# EAGLE design cnc-cape (EAGLE 6.6.0)

## Sheet 1 of 4
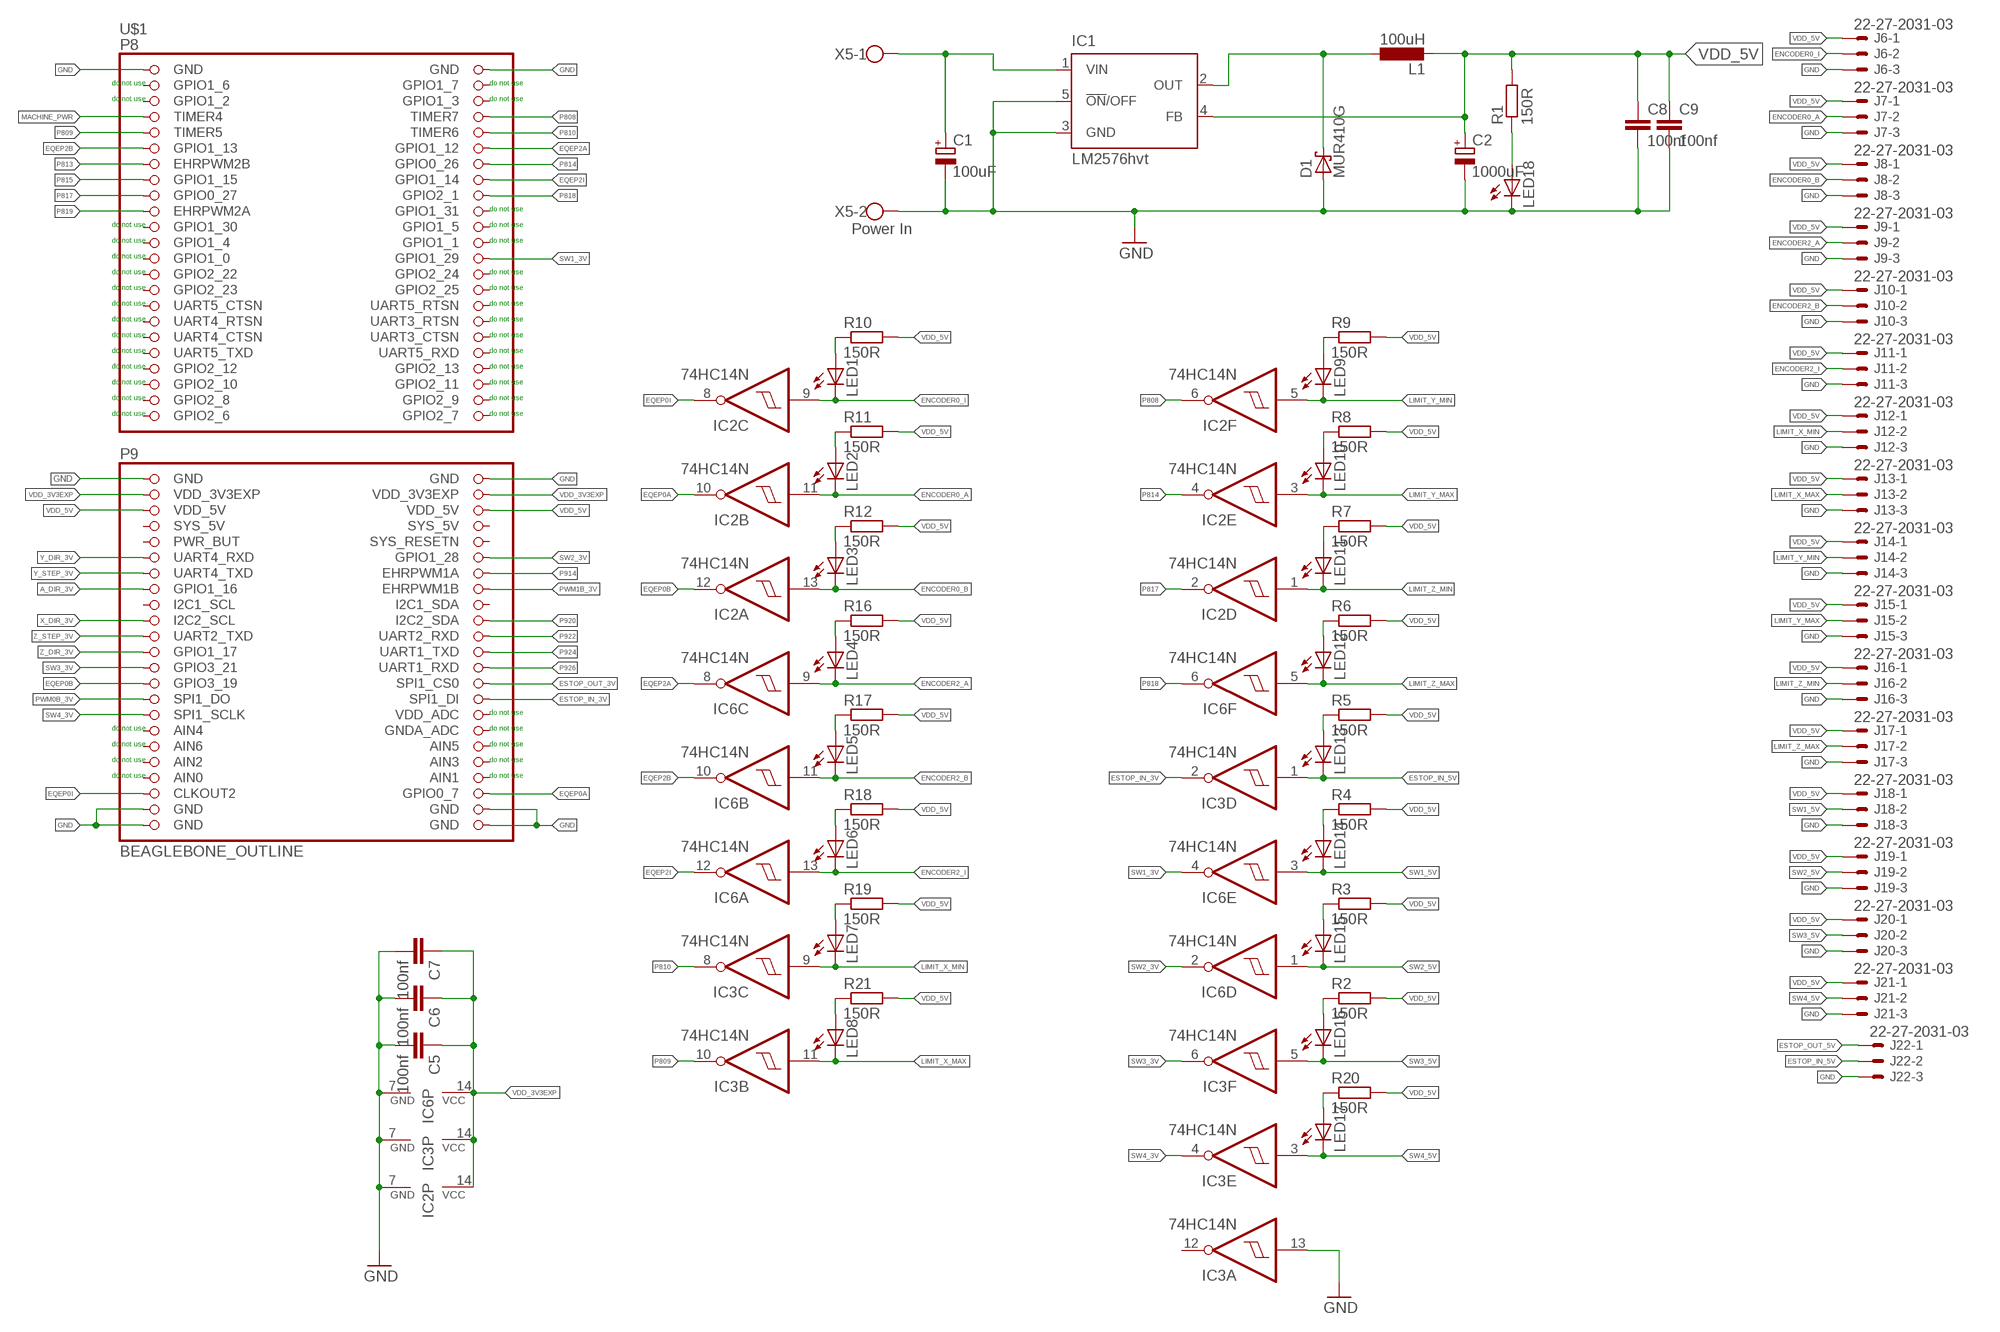
[diagram p0: schematic, sheet 1]

### Parts
C1  100uF  CPOL-EUE5-10.5  [E5-10,5]
C2  1000uF  CPOL-EUE5-10.5  [E5-10,5]
C5  100nf  C-EU050-024X044  [C050-024X044]
C6  100nf  C-EU050-024X044  [C050-024X044]
C7  100nf  C-EU050-024X044  [C050-024X044]
C8  100nf  C-EU050-024X044  [C050-024X044]
C9  100nf  C-EU050-024X044  [C050-024X044]
D1  MUR410G  SCHOTTKY-DIODEDO201T15  [DO201T15]
IC1  LM2576hvt  LM2596T  [T05D]
IC2  74HC14N  [DIL14]
IC3  74HC14N  [DIL14]
IC6  74HC14N  [DIL14]
J6  22-27-2031-03  [6410-03]
J7  22-27-2031-03  [6410-03]
J8  22-27-2031-03  [6410-03]
J9  22-27-2031-03  [6410-03]
J10  22-27-2031-03  [6410-03]
J11  22-27-2031-03  [6410-03]
J12  22-27-2031-03  [6410-03]
J13  22-27-2031-03  [6410-03]
J14  22-27-2031-03  [6410-03]
J15  22-27-2031-03  [6410-03]
J16  22-27-2031-03  [6410-03]
J17  22-27-2031-03  [6410-03]
J18  22-27-2031-03  [6410-03]
J19  22-27-2031-03  [6410-03]
J20  22-27-2031-03  [6410-03]
J21  22-27-2031-03  [6410-03]
J22  22-27-2031-03  [6410-03]
L1  100uH  L-EU  [KM-4.0]
LED1  LED3MM  [LED3MM]
LED2  LED3MM  [LED3MM]
LED3  LED3MM  [LED3MM]
LED4  LED3MM  [LED3MM]
LED5  LED3MM  [LED3MM]
LED6  LED3MM  [LED3MM]
LED7  LED3MM  [LED3MM]
LED8  LED3MM  [LED3MM]
LED9  LED3MM  [LED3MM]
LED10  LED3MM  [LED3MM]
LED11  LED3MM  [LED3MM]
LED12  LED3MM  [LED3MM]
LED13  LED3MM  [LED3MM]
LED14  LED3MM  [LED3MM]
LED15  LED3MM  [LED3MM]
LED16  LED3MM  [LED3MM]
LED17  LED3MM  [LED3MM]
LED18  LED3MM  [LED3MM]
R1  150R  R-EU_0204/5  [0204/5]
R2  150R  R-EU_0204/5  [0204/5]
R3  150R  R-EU_0204/5  [0204/5]
R4  150R  R-EU_0204/5  [0204/5]
R5  150R  R-EU_0204/5  [0204/5]
R6  150R  R-EU_0204/5  [0204/5]
R7  150R  R-EU_0204/5  [0204/5]
R8  150R  R-EU_0204/5  [0204/5]
R9  150R  R-EU_0204/5  [0204/5]
R10  150R  R-EU_0204/5  [0204/5]
R11  150R  R-EU_0204/5  [0204/5]
R12  150R  R-EU_0204/5  [0204/5]
R16  150R  R-EU_0204/5  [0204/5]
R17  150R  R-EU_0204/5  [0204/5]
R18  150R  R-EU_0204/5  [0204/5]
R19  150R  R-EU_0204/5  [0204/5]
R20  150R  R-EU_0204/5  [0204/5]
R21  150R  R-EU_0204/5  [0204/5]
U$1  BEAGLEBONE_OUTLINE  [BEAGLEBONE_SHIELD]
X5  Power In  W237-102  [W237-102]

### Nets
A_DIR_3V: U$1.61(GPIO1_16) ; also sheet 2
ENCODER0_A: IC2.11(B:I) J7.2 LED2.K(C)
ENCODER0_B: IC2.13(A:I) J8.2 LED3.K(C)
ENCODER0_I: IC2.9(C:I) J6.2 LED1.K(C)
ENCODER2_A: IC6.9(C:I) J9.2 LED4.K(C)
ENCODER2_B: IC6.11(B:I) J10.2 LED5.K(C)
ENCODER2_I: IC6.13(A:I) J11.2 LED6.K(C)
EQEP0A: IC2.10(B:O) U$1.88(GPIO0_7)
EQEP0B: IC2.12(A:O) U$1.73(GPIO3_19)
EQEP0I: IC2.8(C:O) U$1.87(CLKOUT2)
EQEP2A: IC6.8(C:O) U$1.12(GPIO1_12)
EQEP2B: IC6.10(B:O) U$1.11(GPIO1_13)
EQEP2I: IC6.12(A:O) U$1.16(GPIO1_14)
ESTOP_IN_3V: IC3.2(D:O) U$1.76(SPI1_DI)
ESTOP_IN_5V: IC3.1(D:I) J22.2 LED13.K(C) ; also sheet 2
ESTOP_OUT_3V: U$1.74(SPI1_CS0) ; also sheet 2
ESTOP_OUT_5V: J22.1 ; also sheet 2
GND [power]: C1.- C2.- C5.2 C6.2 C7.2 C8.2 C9.2 D1.A IC1.3(GND) IC1.5(!ON!/OFF) IC2.7(P:GND) IC3.7(P:GND) IC3.13(A:I) IC6.7(P:GND) J6.3 J7.3 J8.3 J9.3 J10.3 J11.3 J12.3 J13.3 J14.3 J15.3 J16.3 J17.3 J18.3 J19.3 J20.3 J21.3 J22.3 LED18.K(C) U$1.1(GND) U$1.2(GND) U$1.47(GND) U$1.48(GND) U$1.89(GND) U$1.90(GND) U$1.91(GND) U$1.92(GND) X5.2 ; also sheet 2,3,4
LIMIT_X_MAX: IC3.11(B:I) J13.2 LED8.K(C)
LIMIT_X_MIN: IC3.9(C:I) J12.2 LED7.K(C)
LIMIT_Y_MAX: IC2.3(E:I) J15.2 LED10.K(C)
LIMIT_Y_MIN: IC2.5(F:I) J14.2 LED9.K(C)
LIMIT_Z_MAX: IC6.5(F:I) J17.2 LED12.K(C)
LIMIT_Z_MIN: IC2.1(D:I) J16.2 LED11.K(C)
MACHINE_PWR: U$1.7(TIMER4) ; also sheet 2
N$1: LED8.A R21.1
N$2: LED7.A R19.1
N$3: D1.C IC1.2(OUT) L1.P$1
N$4: LED6.A R18.1
N$5: LED5.A R17.1
N$6: LED4.A R16.1
N$7: LED16.A R2.1
N$8: LED15.A R3.1
N$9: LED14.A R4.1
N$10: LED13.A R5.1
N$11: LED12.A R6.1
N$12: LED3.A R12.1
N$13: LED2.A R11.1
N$16: LED1.A R10.1
N$40: LED9.A R9.1
N$41: LED10.A R8.1
N$42: LED11.A R7.1
N$43: LED17.A R20.1
N$44: LED18.A R1.1
P808: IC2.6(F:O) U$1.8(TIMER7)
P809: IC3.10(B:O) U$1.9(TIMER5)
P810: IC3.8(C:O) U$1.10(TIMER6)
P813: U$1.13(EHRPWM2B) ; also sheet 2
P814: IC2.4(E:O) U$1.14(GPIO0_26)
P815: U$1.15(GPIO1_15) ; also sheet 2
P817: IC2.2(D:O) U$1.17(GPIO0_27)
P818: IC6.6(F:O) U$1.18(GPIO2_1)
P819: U$1.19(EHRPWM2A) ; also sheet 2
P914: U$1.60(EHRPWM1A) ; also sheet 2
P920: U$1.66(I2C2_SDA) ; also sheet 2
P922: U$1.68(UART2_RXD) ; also sheet 2
P924: U$1.70(UART1_TXD) ; also sheet 2
P926: U$1.72(UART1_RXD) ; also sheet 2
PWM0B_3V: U$1.75(SPI1_DO) ; also sheet 2
PWM1B_3V: U$1.62(EHRPWM1B) ; also sheet 2
SW1_3V: IC6.4(E:O) U$1.26(GPIO1_29)
SW1_5V: IC6.3(E:I) J18.2 LED14.K(C)
SW2_3V: IC6.2(D:O) U$1.58(GPIO1_28)
SW2_5V: IC6.1(D:I) J19.2 LED15.K(C)
SW3_3V: IC3.6(F:O) U$1.71(GPIO3_21)
SW3_5V: IC3.5(F:I) J20.2 LED16.K(C)
SW4_3V: IC3.4(E:O) U$1.77(SPI1_SCLK)
SW4_5V: IC3.3(E:I) J21.2 LED17.K(C)
VCC [power]: C1.+ IC1.1(VIN) X5.1
VDD_3V3EXP [power]: C5.1 C6.1 C7.1 IC2.14(P:VCC) IC3.14(P:VCC) IC6.14(P:VCC) U$1.49(VDD_3V3EXP) U$1.50(VDD_3V3EXP)
VDD_5V [power]: C2.+ C8.1 C9.1 IC1.4(FB) J6.1 J7.1 J8.1 J9.1 J10.1 J11.1 J12.1 J13.1 J14.1 J15.1 J16.1 J17.1 J18.1 J19.1 J20.1 J21.1 L1.P$2 R1.2 R2.2 R3.2 R4.2 R5.2 R6.2 R7.2 R8.2 R9.2 R10.2 R11.2 R12.2 R16.2 R17.2 R18.2 R19.2 R20.2 R21.2 U$1.51(VDD_5V) U$1.52(VDD_5V) ; also sheet 2,3,4
X_DIR_3V: U$1.65(I2C2_SCL) ; also sheet 2
Y_DIR_3V: U$1.57(UART4_RXD) ; also sheet 2
Y_STEP_3V: U$1.59(UART4_TXD) ; also sheet 2
Z_DIR_3V: U$1.69(GPIO1_17) ; also sheet 2
Z_STEP_3V: U$1.67(UART2_TXD) ; also sheet 2
Unconnected: IC3.12(A:O) U$1.3(GPIO1_6) U$1.4(GPIO1_7) U$1.5(GPIO1_2) U$1.6(GPIO1_3) U$1.20(GPIO1_31) U$1.21(GPIO1_30) U$1.22(GPIO1_5) U$1.23(GPIO1_4) U$1.24(GPIO1_1) U$1.25(GPIO1_0) U$1.27(GPIO2_22) U$1.28(GPIO2_24) U$1.29(GPIO2_23) U$1.30(GPIO2_25) U$1.31(UART5_CTSN) U$1.32(UART5_RTSN) U$1.33(UART4_RTSN) U$1.34(UART3_RTSN) U$1.35(UART4_CTSN) U$1.36(UART3_CTSN) U$1.37(UART5_TXD) U$1.38(UART5_RXD) U$1.39(GPIO2_12) U$1.40(GPIO2_13) U$1.41(GPIO2_10) U$1.42(GPIO2_11) U$1.43(GPIO2_8) U$1.44(GPIO2_9) U$1.45(GPIO2_6) U$1.46(GPIO2_7) U$1.54(SYS_5V) U$1.55(PWR_BUT) U$1.56(SYS_RESETN) U$1.63(I2C1_SCL) U$1.64(I2C1_SDA) U$1.78(VDD_ADC) U$1.79(AIN4) U$1.80(GNDA_ADC) U$1.81(AIN6) U$1.82(AIN5) U$1.83(AIN2) U$1.84(AIN3) U$1.86(AIN1)

### Notes on the sheet
- do not use | do not use
- do not use | do not use
- do not use
- do not use | do not use
- do not use | do not use
- do not use
- do not use | do not use
- do not use | do not use
- do not use | do not use
- do not use | do not use
- do not use | do not use
- do not use | do not use
- do not use | do not use
- do not use | do not use
- do not use | do not use
- do not use | do not use
- do not use
- do not use | do not use
- do not use | do not use
- do not use | do not use
- do not use | do not use

## Sheet 2 of 4
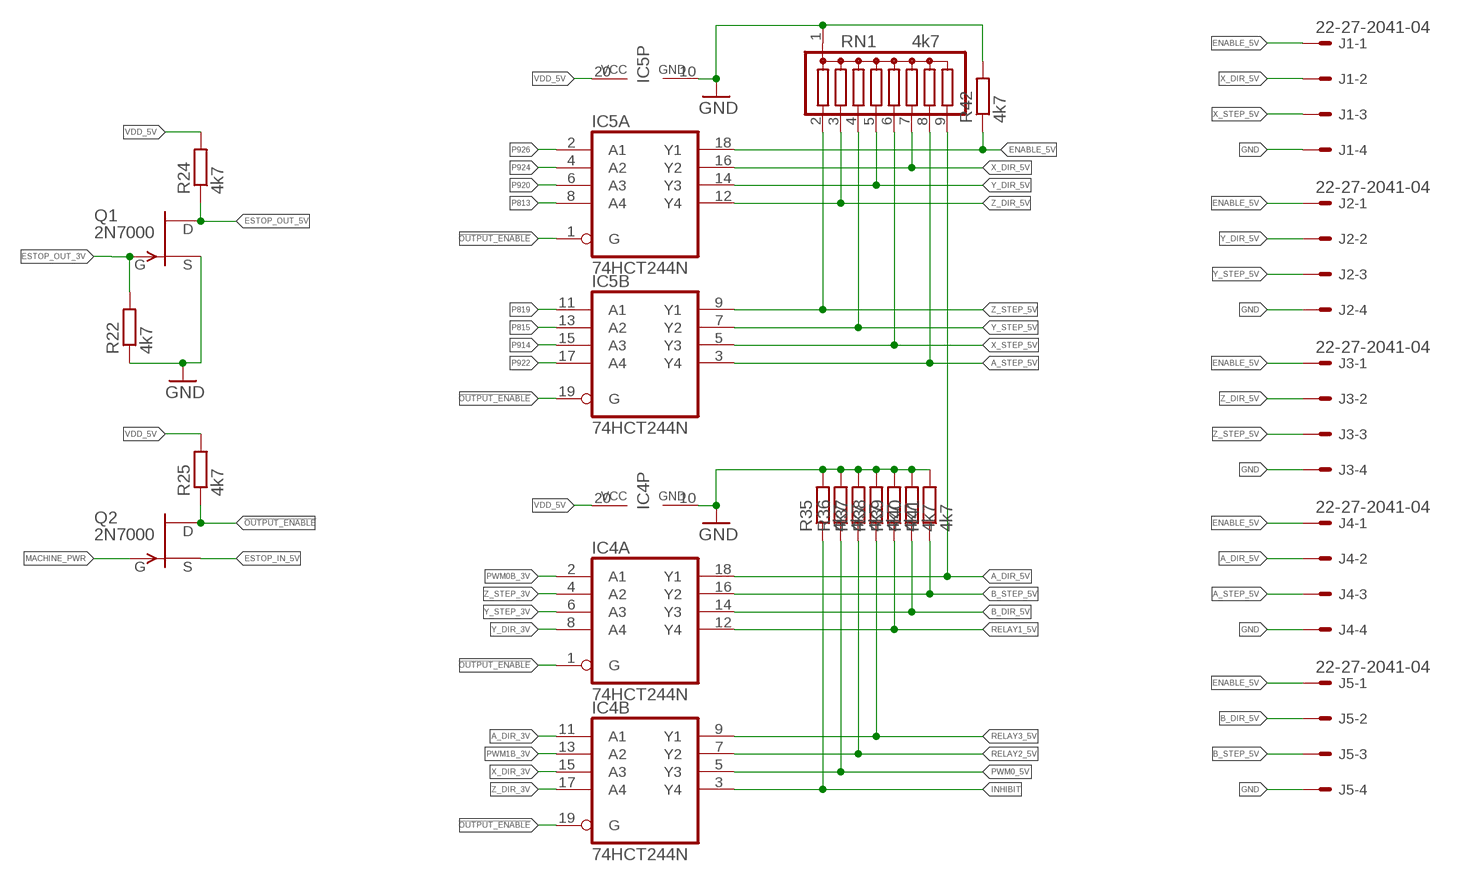
[diagram p1: schematic, sheet 2]

### Parts
IC4  74HCT244N  [DIL20]
IC5  74HCT244N  [DIL20]
J1  22-27-2041-04  [6410-04]
J2  22-27-2041-04  [6410-04]
J3  22-27-2041-04  [6410-04]
J4  22-27-2041-04  [6410-04]
J5  22-27-2041-04  [6410-04]
Q1  2N7000  2N3819  [TO92]
Q2  2N7000  2N3819  [TO92]
R22  4k7  R-EU_0204/5  [0204/5]
R24  4k7  R-EU_0204/5  [0204/5]
R25  4k7  R-EU_0204/5  [0204/5]
R35  4k7  R-EU_0204/5  [0204/5]
R36  4k7  R-EU_0204/5  [0204/5]
R37  4k7  R-EU_0204/5  [0204/5]
R38  4k7  R-EU_0204/5  [0204/5]
R39  4k7  R-EU_0204/5  [0204/5]
R40  4k7  R-EU_0204/5  [0204/5]
R41  4k7  R-EU_0204/5  [0204/5]
R42  4k7  R-EU_0204/5  [0204/5]
RN1  4k7  G08R  [SIL9]

### Nets
!OUTPUT_ENABLE!: IC4.1(A:G) IC4.19(B:G) IC5.1(A:G) IC5.19(B:G) Q2.1(D) R25.1
A_DIR_3V: IC4.11(B:A1) ; also sheet 1
A_DIR_5V: IC4.18(A:Y1) J4.2 RN1.9
A_STEP_5V: IC5.3(B:Y4) J4.3 RN1.8
B_DIR_5V: IC4.14(A:Y3) J5.2 R40.1
B_STEP_5V: IC4.16(A:Y2) J5.3 R41.1
ENABLE_5V: IC5.18(A:Y1) J1.1 J2.1 J3.1 J4.1 J5.1 R42.1
ESTOP_IN_5V: Q2.3(S) ; also sheet 1
ESTOP_OUT_3V: Q1.2(G) R22.2 ; also sheet 1
ESTOP_OUT_5V: Q1.1(D) R24.1 ; also sheet 1
GND [power]: IC4.10(P:GND) IC5.10(P:GND) J1.4 J2.4 J3.4 J4.4 J5.4 Q1.3(S) R22.1 R35.2 R36.2 R37.2 R38.2 R39.2 R40.2 R41.2 R42.2 RN1.1 ; also sheet 1,3,4
INHIBIT: IC4.3(B:Y4) R35.1 ; also sheet 4
MACHINE_PWR: Q2.2(G) ; also sheet 1
P813: IC5.8(A:A4) ; also sheet 1
P815: IC5.13(B:A2) ; also sheet 1
P819: IC5.11(B:A1) ; also sheet 1
P914: IC5.15(B:A3) ; also sheet 1
P920: IC5.6(A:A3) ; also sheet 1
P922: IC5.17(B:A4) ; also sheet 1
P924: IC5.4(A:A2) ; also sheet 1
P926: IC5.2(A:A1) ; also sheet 1
PWM0_5V: IC4.5(B:Y3) R36.1 ; also sheet 4
PWM0B_3V: IC4.2(A:A1) ; also sheet 1
PWM1B_3V: IC4.13(B:A2) ; also sheet 1
RELAY1_5V: IC4.12(A:Y4) R39.1 ; also sheet 3
RELAY2_5V: IC4.7(B:Y2) R37.1 ; also sheet 3
RELAY3_5V: IC4.9(B:Y1) R38.1 ; also sheet 3
VDD_5V [power]: IC4.20(P:VCC) IC5.20(P:VCC) R24.2 R25.2 ; also sheet 1,3,4
X_DIR_3V: IC4.15(B:A3) ; also sheet 1
X_DIR_5V: IC5.16(A:Y2) J1.2 RN1.7
X_STEP_5V: IC5.5(B:Y3) J1.3 RN1.6
Y_DIR_3V: IC4.8(A:A4) ; also sheet 1
Y_DIR_5V: IC5.14(A:Y3) J2.2 RN1.5
Y_STEP_3V: IC4.6(A:A3) ; also sheet 1
Y_STEP_5V: IC5.7(B:Y2) J2.3 RN1.4
Z_DIR_3V: IC4.17(B:A4) ; also sheet 1
Z_DIR_5V: IC5.12(A:Y4) J3.2 RN1.3
Z_STEP_3V: IC4.4(A:A2) ; also sheet 1
Z_STEP_5V: IC5.9(B:Y1) J3.3 RN1.2

## Sheet 3 of 4
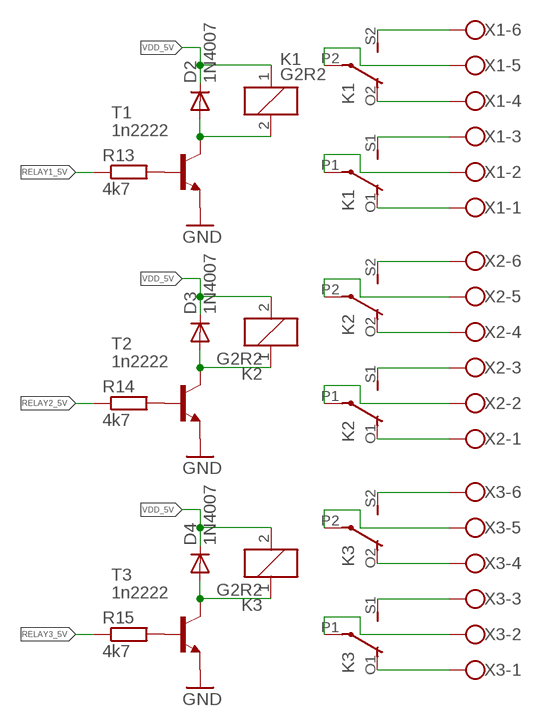
[diagram p2: schematic, sheet 3]

### Parts
D2  1N4007  1N4004  [DO41-10]
D3  1N4007  1N4004  [DO41-10]
D4  1N4007  1N4004  [DO41-10]
K1  G2R2  [G2R2]
K2  G2R2  [G2R2]
K3  G2R2  [G2R2]
R13  4k7  R-EU_0204/5  [0204/5]
R14  4k7  R-EU_0204/5  [0204/5]
R15  4k7  R-EU_0204/5  [0204/5]
T1  1n2222  -NPN-TO92  [TO92]
T2  1n2222  -NPN-TO92  [TO92]
T3  1n2222  -NPN-TO92  [TO92]
X1  W237-6  [W237-6]
X2  W237-6  [W237-6]
X3  W237-6  [W237-6]

### Nets
GND [power]: T1.1(E) T2.1(E) T3.1(E) ; also sheet 1,2,4
N$15: R13.2 T1.2(B)
N$17: D2.A K1.2 T1.3(C)
N$18: K1.S2(3:S) X1.6
N$19: K1.O2(3:O) X1.4
N$20: K1.P2(3:P) X1.5
N$21: K1.S1(2:S) X1.3
N$22: K1.P1(2:P) X1.2
N$23: K1.O1(2:O) X1.1
N$24: R14.2 T2.2(B)
N$25: D3.A K2.1 T2.3(C)
N$26: K2.S2(3:S) X2.6
N$27: K2.O2(3:O) X2.4
N$28: K2.P2(3:P) X2.5
N$29: K2.S1(2:S) X2.3
N$30: K2.P1(2:P) X2.2
N$31: K2.O1(2:O) X2.1
N$32: R15.2 T3.2(B)
N$33: D4.A K3.1 T3.3(C)
N$34: K3.S2(3:S) X3.6
N$35: K3.O2(3:O) X3.4
N$36: K3.P2(3:P) X3.5
N$37: K3.S1(2:S) X3.3
N$38: K3.P1(2:P) X3.2
N$39: K3.O1(2:O) X3.1
RELAY1_5V: R13.1 ; also sheet 2
RELAY2_5V: R14.1 ; also sheet 2
RELAY3_5V: R15.1 ; also sheet 2
VDD_5V [power]: D2.C D3.C D4.C K1.1 K2.2 K3.2 ; also sheet 1,2,4

## Sheet 4 of 4
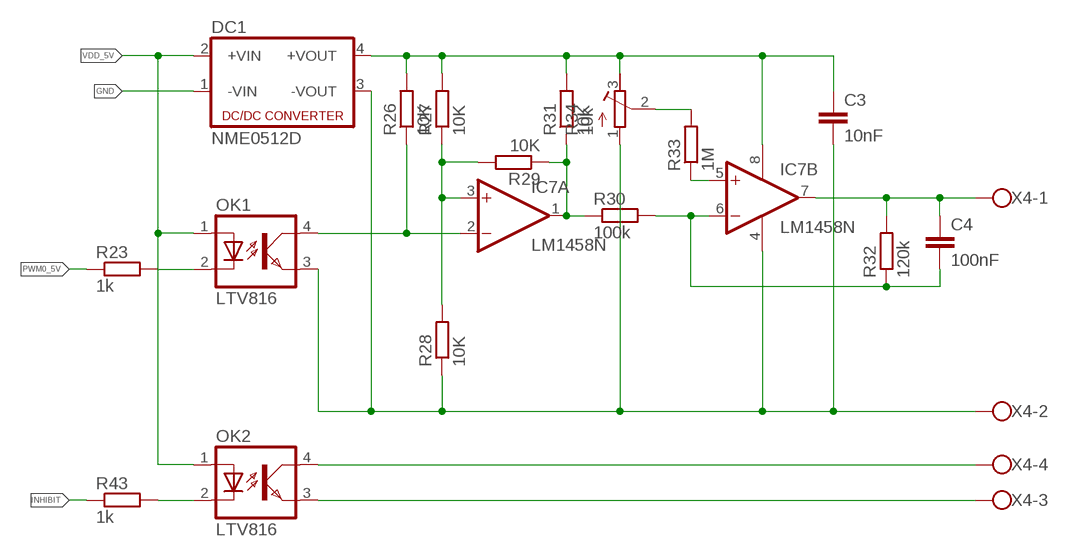
[diagram p3: schematic, sheet 4]

### Parts
C3  10nF  C-EU050-024X044  [C050-024X044]
C4  100nF  C-EU050-024X044  [C050-024X044]
DC1  NME0512D  NME  [NME]
IC7  LM1458N  [DIL08]
OK1  LTV816  [DIL04]
OK2  LTV816  [DIL04]
R23  1k  R-EU_0204/5  [0204/5]
R26  10K  R-EU_0204/5  [0204/5]
R27  10K  R-EU_0204/5  [0204/5]
R28  10K  R-EU_0204/5  [0204/5]
R29  10K  R-EU_0204/5  [0204/5]
R30  100k  R-EU_0204/5  [0204/5]
R31  10K  R-EU_0204/5  [0204/5]
R32  120k  R-EU_0204/5  [0204/5]
R33  1M  R-EU_0204/5  [0204/5]
R34  10k  R-TRIMM64P  [RTRIM64P]
R43  1k  R-EU_0204/5  [0204/5]
X4  W237-4  [W237-4]

### Nets
GND [power]: DC1.1(-VIN) ; also sheet 1,2,3
INHIBIT: R43.1 ; also sheet 2
N$14: C3.1 DC1.4(+VOUT) IC7.8(P:V+) R26.2 R27.2 R31.2 R34.3(E)
N$45: OK1.2(C) R23.2
N$46: OK2.4(COL) X4.4
N$47: IC7.2(A:-IN) OK1.4(COL) R26.1
N$48: IC7.3(A:+IN) R27.1 R28.2 R29.2
N$49: IC7.1(A:OUT) R29.1 R30.1 R31.1
N$50: C4.2 IC7.6(B:-IN) R30.2 R32.1
N$51: OK2.3(EMIT) X4.3
N$52: OK2.2(C) R43.2
N$53: IC7.5(B:+IN) R33.1
N$54: R33.2 R34.2(S)
PWM0_5V: R23.1 ; also sheet 2
SPINDLE+: C4.1 IC7.7(B:OUT) R32.2 X4.1
SPINDLE-: C3.2 DC1.3(-VOUT) IC7.4(P:V-) OK1.3(EMIT) R28.1 R34.1(A) X4.2
VDD_5V [power]: DC1.2(+VIN) OK1.1(A) OK2.1(A) ; also sheet 1,2,3

## Power pins joined to a net without a drawn wire
AIN0: U$1.85(AIN0)
SYS_5V: U$1.53(SYS_5V)

## Library data of the parts
C1 = resistor:CPOL-EU: POLARIZED CAPACITOR, European symbol; FARNELL: 1281843
C2 = resistor:CPOL-EU: POLARIZED CAPACITOR, European symbol; FARNELL: 2346582
C3-C9 = rcl:C-EU: CAPACITOR, European symbol
D1 = diode:SCHOTTKY-DIODE: Schottky Diode; FARNELL: 1459145
D2-D4 = diode:1N4004: DIODE general purpose rectifier, 1 A; FARNELL: 9565051
DC1 = dc-dc-converter:NME: DC-DC CONVERTER; FARNELL: 1021457; MF: C & D TECHNOLOGIES, INC; MPN: NME1205D; OC_FARNELL: 1021466; OC_NEWARK: 98B8198
IC1 = national-semiconductor:LM2596: SIMPLE SWITCHER® Power Converter 150 kHz 3A Step-Down Voltage Regulator Source: http://www.national.com/ds/LM/LM2596.pdf; MPN: LM2596T-ADJ/LF02; OC_FARNELL: 9494162; OC_NEWARK: 65K5910
IC2 IC3 IC6 = 74xx-eu:74*14: Hex schmitt trigger INVERTER; FARNELL: 1739974
IC4 IC5 = 74xx-eu:74*244: Octal BUFFER and LINE DRIVER, 3-state; FARNELL: 382267
IC7 = linear:*1458: OP AMP
J1-J5 = con-molex:22-?-04: CONNECTOR wire to board 2.54 mm (.1 inch) pitch header; FARNELL: 9731164; OC_FARNELL: unknown; OC_NEWARK: unknown
J6-J8 J10-J21 = con-molex:22-?-03: CONNECTOR wire to board 2.54 mm (.1 inch) pitch header; FARNELL: 9731156; OC_FARNELL: unknown; OC_NEWARK: unknown
J9 J22 = con-molex:22-?-03: CONNECTOR wire to board 2.54 mm (.1 inch) pitch header; OC_FARNELL: unknown; OC_NEWARK: unknown
K1-K3 = relay:G2R2: RELAY 2 x switch, Omron; FARNELL: 1703716; MF: OMRON COMPONENTS USA; MPN: G2R-2-DC6; OC_FARNELL: unknown; OC_NEWARK: 89C5317
L1 = library:L-EU: INDUCTOR, European symbol; FARNELL: 1209546
LED1-LED18 = led:LED: LED OSRAM: - CHIPLED LG R971, LG N971, LY N971, LG Q971, LY Q971, LO R971, LY R971 LH N974, LH R974 LS Q976, LO Q976, LY Q976 LO Q996 - Hyper CHIPLED LW Q18S LB Q993, LB Q99A, LB R99A - SideLED LS A670, LO A670, LY A670, LG A670, LP A670 LB A673, LV A673, LT A673, LW A673 LH A674 LY A675 LS A676, LA A676, LO A676, LY A676, LW A676 LS A679, LY A679, LG A679 - Hyper Micro SIDELED® LS Y876, LA Y876, LO Y876, LY Y876 LT Y87S - SmartLED LW L88C, LW L88S LB L89C, LB L89S, LG L890 LS L89K, LO L89K, LY L89K LS L896, LA L896, LO L896, LY L896 - TOPLED LS T670, LO T670, LY T670, LG T670, LP T670 LSG T670, LSP T670, LSY T670, LOP T670, LYG T670 LG T671, LOG T671, LSG T671 LB T673, LV T673, LT T673, LW T673 LH T674 LS T676, LA T676, LO T676, LY T676, LB T676, LH T676, LSB T676, LW T676 LB T67C, LV T67C, LT T67C, LS T67K, LO T67K, LY T67K, LW E67C LS E67B, LA E67B, LO E67B, LY E67B, LB E67C, LV E67C, LT E67C LW T67C LS T679, LY T679, LG T679 LS T770, LO T770, LY T770, LG T770, LP T770 LB T773, LV T773, LT T773, LW T773 LH T774 LS E675, LA E675, LY E675, LS T675 LS T776, LA T776, LO T776, LY T776, LB T776 LHGB T686 LT T68C, LB T68C - Hyper Mini TOPLED® LB M676 - Mini TOPLED Santana® LG M470 LS M47K, LO M47K, LY M47K Source: http://www.osram.convergy.de LUXEON: - LUMILED® LXK2-PW12-R00, LXK2-PW12-S00, LXK2-PW14-U00, LXK2-PW14-V00 LXK2-PM12-R00, LXK2-PM12-S00, LXK2-PM14-U00 LXK2-PE12-Q00, LXK2-PE12-R00, LXK2-PE12-S00, LXK2-PE14-T00, LXK2-PE14-U00 LXK2-PB12-K00, LXK2-PB12-L00, LXK2-PB12-M00, LXK2-PB14-N00, LXK2-PB14-P00, LXK2-PB14-Q00 LXK2-PR12-L00, LXK2-PR12-M00, LXK2-PR14-Q00, LXK2-PR14-R00 LXK2-PD12-Q00, LXK2-PD12-R00, LXK2-PD12-S00 LXK2-PH12-R00, LXK2-PH12-S00 LXK2-PL12-P00, LXK2-PL12-Q00, LXK2-PL12-R00 Source: www.luxeon.com KINGBRIGHT: KA-3528ASYC Source: www.kingbright.com; FARNELL: 1581133
OK1 OK2 = optocoupler:LTV816: OPTO COUPLER Source: LITEON, LTV816.pdf; OC_FARNELL: unknown; OC_NEWARK: unknown
Q1 Q2 = transistor-fet:2N3819: N-Channel Junction FET; FARNELL: 9845178
R1-R12 R16-R21 = resistor:R-EU_: RESISTOR, European symbol; FARNELL: 1700226
R13-R15 R22 R24 R25 = rcl:R-EU_: RESISTOR, European symbol; FARNELL: 1700245
R23 R30 R32 R33 R35-R43 = rcl:R-EU_: RESISTOR, European symbol
R26-R29 R31 = rcl:R-EU_: RESISTOR, European symbol; FARNELL: 1700251
R34 = rcl:R-TRIMM: Trimm resistor
RN1 = resistor-sil:G08R: SIL RESISTOR; FARNELL: 9357025; OC_FARNELL: unknown; OC_NEWARK: unknown
T1-T3 = transistor:*-NPN-: NPN Transistror BF959 corrected 2008.03.06; FARNELL: 1611371
U$1 = adafruit:BEAGLEBONE_OUTLINE: Should match A3 pinout - but not completely tested
X1-X3 = con-wago-500:W237-6: WAGO SCREW CLAMP; FARNELL: 3089071; OC_FARNELL: unknown; OC_NEWARK: unknown
X4 = con-wago-500:W237-4: WAGO SCREW CLAMP; OC_FARNELL: unknown; OC_NEWARK: unknown
X5 = con-wago-500:W237-102: WAGO SCREW CLAMP; FARNELL: 3089034; MPN: 237-102; OC_FARNELL: unknown; OC_NEWARK: 70K9898

## Board
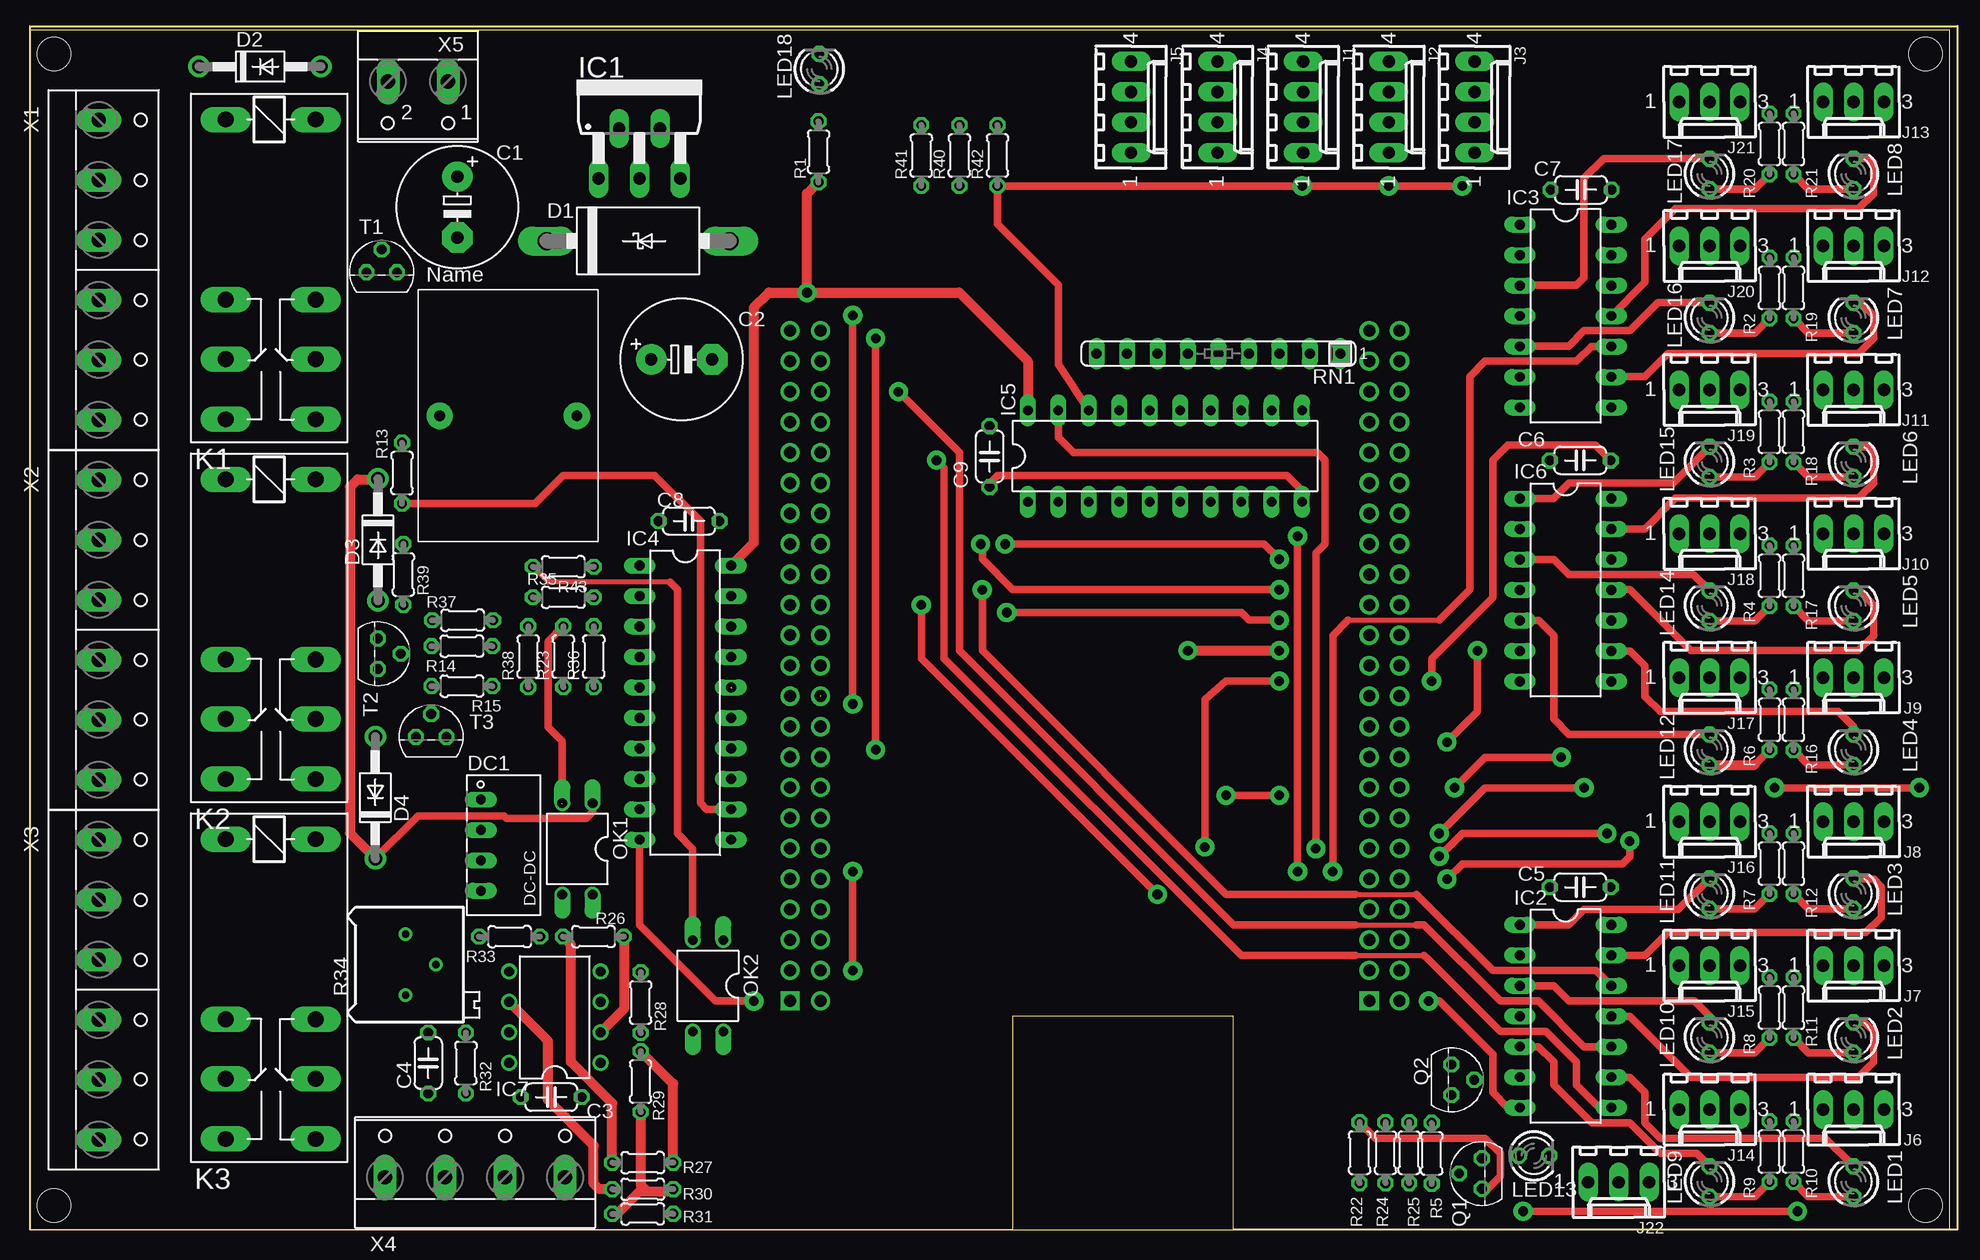
[diagram p4: board, top side]
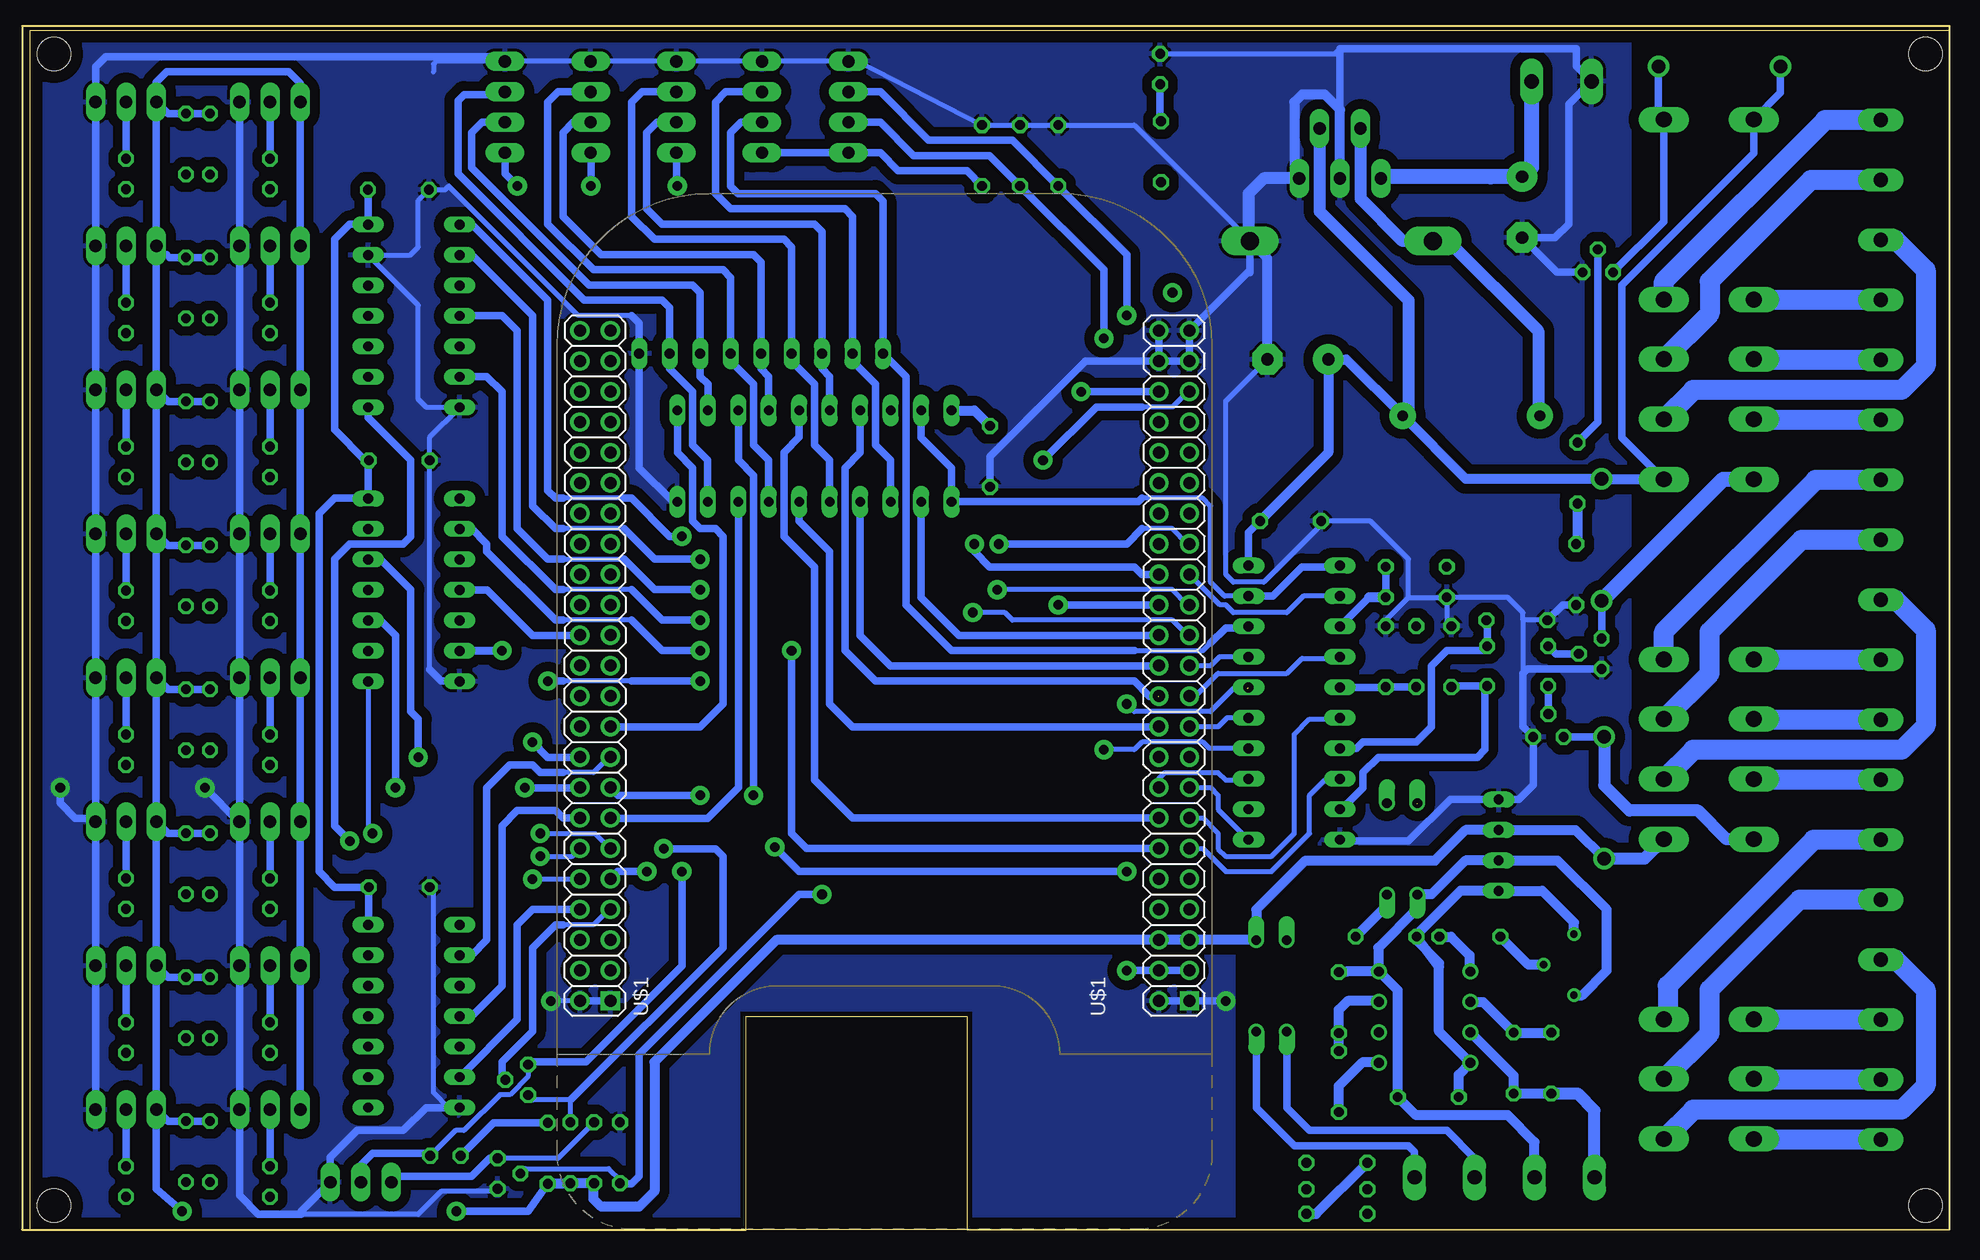
[diagram p5: board, bottom side, seen from below]

Size 160 x 100 mm. Coordinates in mm from the lower left corner, seen from the top.
Outline: 160,0 160,100 0,100 0,0 160,0
Copper layers (1*16): Top 0.035mm / dielectric 1.5mm / Bottom 0.035mm
Design rules "default *": minimum track width 10mil, minimum drill 24mil, track to track 8mil, track to pad 8mil, pad to pad 8mil, via to via 8mil, smd to smd 8mil, copper to edge 40mil, drill to drill 8mil, minimum pad ring 10mil, minimum via ring 8mil, stop-mask expansion 4mil, vias tented up to drill 0mil, thermal gap 10mil
Holes 2.8 mm at 2,2 2,98 158,98 158,2
Milling: 8 lines

### Footprints (pad centres in the part's own frame; a part is rotated, then mirrored left to right if it is on the bottom)
E5-10,5 = drill 1.016 pad 2.54: + -2.54,0 | drill 1.016 pad 2.54 octagon: - 2.54,0
C050-024X044 = drill 0.813 octagon: 1 -2.54,0; 2 2.54,0
DO201T15 = drill 1.499 long: A 7.62,0; C -7.62,0
DO41-10 = drill 1.118: A 5.08,0; C -5.08,0
NME = drill 0.813 long: 1 0,3.81; 2 0,1.27; 3 0,-1.27; 4 0,-3.81
T05D = drill 1.016 long: 1 -3.404,-5.08; 2 -1.702,-0.914; 3 0,-5.08; 4 1.702,-0.914; 5 3.404,-5.08
DIL14 = drill 0.813 long: 1 -7.62,-3.81; 2 -5.08,-3.81; 3 -2.54,-3.81; 4 0,-3.81; 5 2.54,-3.81; 6 5.08,-3.81; 7 7.62,-3.81; 8 7.62,3.81; 9 5.08,3.81; 10 2.54,3.81; 11 0,3.81; 12 -2.54,3.81; 13 -5.08,3.81; 14 -7.62,3.81
DIL20 = drill 0.813 long: 1 -11.43,-3.81; 2 -8.89,-3.81; 3 -6.35,-3.81; 4 -3.81,-3.81; 5 -1.27,-3.81; 6 1.27,-3.81; 7 3.81,-3.81; 8 6.35,-3.81; 9 8.89,-3.81; 10 11.43,-3.81; 11 11.43,3.81; 12 8.89,3.81; 13 6.35,3.81; 14 3.81,3.81; 15 1.27,3.81; 16 -1.27,3.81; 17 -3.81,3.81; 18 -6.35,3.81; 19 -8.89,3.81; 20 -11.43,3.81
DIL08 = drill 0.813 pad 1.27: 1 -3.81,-3.81; 2 -1.27,-3.81; 3 1.27,-3.81; 4 3.81,-3.81; 5 3.81,3.81; 6 1.27,3.81; 7 -1.27,3.81; 8 -3.81,3.81
6410-04 = drill 1.016 long: 1 3.81,0; 2 1.27,0; 3 -1.27,0; 4 -3.81,0
6410-03 = drill 1.016 long: 1 2.54,0; 2 0,0; 3 -2.54,0
G2R2 = drill 1.321 long: 1 -2.54,-3.683; 2 -2.54,3.81; O1 12.471,3.81; O2 12.471,-3.683; P1 17.45,3.81; P2 17.45,-3.683; S1 22.454,3.81; S2 22.454,-3.683
KM-4.0 = drill 0.9 pad 2.184: P$1 -5.72,0; P$2 5.72,0
LED3MM = drill 0.813 octagon: A -1.27,0; K 1.27,0
DIL04 = drill 0.813 offset: 1 -1.27,-3.81; 2 1.27,-3.81; 3 1.27,3.81; 4 -1.27,3.81
TO92 = drill 0.813 octagon: 1 1.27,0; 2 0,1.905; 3 -1.27,0
0204/5 = drill 0.813 octagon: 1 -2.54,0; 2 2.54,0
RTRIM64P = drill 0.61: 1 0,-2.54; 2 2.54,0; 3 0,2.54
SIL9 = drill 0.813 long: 1 -10.16,0; 2 -7.62,0; 3 -5.08,0; 4 -2.54,0; 5 0,0; 6 2.54,0; 7 5.08,0; 8 7.62,0; 9 10.16,0
BEAGLEBONE_SHIELD = drill 1 square: 1 4.445,19.05; 47 52.705,19.05 | drill 1: 2 1.905,19.05; 3 4.445,21.59; 4 1.905,21.59; 5 4.445,24.13; 6 1.905,24.13; 7 4.445,26.67; 8 1.905,26.67; 9 4.445,29.21; 10 1.905,29.21; 11 4.445,31.75; 12 1.905,31.75; 13 4.445,34.29; 14 1.905,34.29; 15 4.445,36.83; 16 1.905,36.83; 17 4.445,39.37; 18 1.905,39.37; 19 4.445,41.91; 20 1.905,41.91; 21 4.445,44.45; 22 1.905,44.45; 23 4.445,46.99; 24 1.905,46.99; 25 4.445,49.53; 26 1.905,49.53; 27 4.445,52.07; 28 1.905,52.07; 29 4.445,54.61; 30 1.905,54.61; 31 4.445,57.15; 32 1.905,57.15; 33 4.445,59.69; 34 1.905,59.69; 35 4.445,62.23; 36 1.905,62.23; 37 4.445,64.77; 38 1.905,64.77; 39 4.445,67.31; 40 1.905,67.31; 41 4.445,69.85; 42 1.905,69.85; 43 4.445,72.39; 44 1.905,72.39; 45 4.445,74.93; 46 1.905,74.93; 48 50.165,19.05; 49 52.705,21.59; 50 50.165,21.59; 51 52.705,24.13; 52 50.165,24.13; 53 52.705,26.67; 54 50.165,26.67; 55 52.705,29.21; 56 50.165,29.21; 57 52.705,31.75; 58 50.165,31.75; 59 52.705,34.29; 60 50.165,34.29; 61 52.705,36.83; 62 50.165,36.83; 63 52.705,39.37; 64 50.165,39.37; 65 52.705,41.91; 66 50.165,41.91; 67 52.705,44.45; 68 50.165,44.45; 69 52.705,46.99; 70 50.165,46.99; 71 52.705,49.53; 72 50.165,49.53; 73 52.705,52.07; 74 50.165,52.07; 75 52.705,54.61; 76 50.165,54.61; 77 52.705,57.15; 78 50.165,57.15; 79 52.705,59.69; 80 50.165,59.69; 81 52.705,62.23; 82 50.165,62.23; 83 52.705,64.77; 84 50.165,64.77; 85 52.705,67.31; 86 50.165,67.31; 87 52.705,69.85; 88 50.165,69.85; 89 52.705,72.39; 90 50.165,72.39; 91 52.705,74.93; 92 50.165,74.93
W237-6 = drill 1.194 long: 1 -12.5,-1.27; 2 -7.5,-1.27; 3 -2.5,-1.27; 4 2.5,-1.27; 5 7.5,-1.27; 6 12.5,-1.27
W237-4 = drill 1.194 long: 1 -7.5,-1.27; 2 -2.5,-1.27; 3 2.5,-1.27; 4 7.5,-1.27
W237-102 = drill 1.194 long: 1 -2.5,-1.27; 2 2.5,-1.27

### Placement (x,y rotation side)
C1  35.62,85.23 270 top
C2  54.31,72.54 0 top
C3  43.45,11.04 0 top
C4  33.2,13.88 90 top
C5  129.22,28.54 180 top
C6  129.22,64.11 180 top
C7  129.29,86.68 180 top
C8  54.92,59.06 180 top
C9  79.98,64.45 270 top
D1  50.69,82.42 0 top
D2  19.18,96.94 0 top
D3  29,57.5 270 top
D4  28.79,36 90 top
DC1  37.58,32.04 0 top
IC1  50.8,92.71 0 top
IC2  128,17.78 270 top
IC3  128,76.16 270 top
IC4  54.62,43.92 270 top
IC5  94.61,64.48 0 top
IC6  128,53.32 270 top
IC7  43.74,17.7 90 top
J1  106.12,93.57 270 top
J2  113.27,93.57 270 top
J3  120.42,93.57 270 top
J4  98.98,93.57 270 top
J5  91.78,93.57 270 top
J6  152,10 180 top
J7  152,22 180 top
J8  152,34 180 top
J9  152,46 180 top
J10  152,58 180 top
J11  152,70 180 top
J12  152,82 180 top
J13  152,94 180 top
J14  140,10 180 top
J15  140,22 180 top
J16  140,34 180 top
J17  140,46 180 top
J18  140,58 180 top
J19  140,70 180 top
J20  140,82 180 top
J21  140,94 180 top
J22  132.42,3.94 180 top
K1  20,90 270 top
K2  20,60 270 top
K3  20,30 270 top
L1  39.86,67.84 0 top
LED1  152,4 90 top
LED2  152,16 90 top
LED3  152,28 90 top
LED4  152,40 90 top
LED5  152,52 90 top
LED6  152,64 90 top
LED7  152,76 90 top
LED8  152,88 90 top
LED9  140,4 90 top
LED10  140,16 90 top
LED11  140,28 90 top
LED12  140,40 90 top
LED13  125.37,6.15 0 top
LED14  140,52 90 top
LED15  140,64 90 top
LED16  140,76 90 top
LED17  140,88 90 top
LED18  65.8,96.75 90 top
OK1  45.62,31.73 180 top
OK2  56.52,20.32 180 top
Q1  121.03,4.67 90 top
Q2  118.48,12.48 270 top
R1  65.72,89.85 270 top
R2  145,78.5 90 top
R3  145,66.5 90 top
R4  145,54.5 90 top
R5  116.84,6.35 270 top
R6  145,42.5 90 top
R7  145,30.5 90 top
R8  145,18.5 90 top
R9  145,6.5 90 top
R10  147,6.5 90 top
R11  147,18.5 90 top
R12  147,30.5 90 top
R13  31.01,63.06 90 top
R14  36,48.63 180 top
R15  36,45.3 180 top
R16  147,42.5 90 top
R17  147,54.5 90 top
R18  147,66.5 90 top
R19  147,78.5 90 top
R20  145,90.5 90 top
R21  147,90.5 90 top
R22  110.83,6.4 270 top
R23  44.45,47.76 90 top
R24  112.98,6.4 270 top
R25  114.95,6.4 270 top
R26  46.97,24.41 180 top
R27  51.07,5.57 180 top
R28  50.9,18.92 270 top
R29  50.9,12.34 90 top
R30  51.07,3.35 180 top
R31  51.07,1.3 0 top
R32  36.33,13.88 270 top
R33  39.98,24.41 180 top
R34  31.3,22.08 0 top
R35  44.45,52.7 180 top
R36  46.99,47.76 90 top
R37  36.06,50.8 180 top
R38  41.52,47.76 90 top
R39  31.11,54.61 270 top
R40  77.47,89.53 90 top
R41  74.3,89.53 90 top
R42  80.64,89.53 90 top
R43  44.45,55.24 180 top
RN1  99.06,73.03 180 top
T1  29.32,79.8 0 top
T2  29,48 270 top
T3  33.44,41.06 0 top
U$1  116.07,0.01 0 bottom
X1  7,80 270 top
X2  7,50 270 top
X3  7,20 270 top
X4  37.09,5.62 0 top
X5  32.34,94.44 180 top

### Tracks (layer width: path | path; a pad name or v marks a point on that pad's centre or on a via)
!OUTPUT_ENABLE!  (via drill 0.8)
  Top 0.61: v107.18,31.75 107.18,56.38 107.95,57.15 107.95,64.14 107.31,64.77 87,64.77 85.72,66.04 IC5.19
  Bottom 0.406: 114.94,8.96 R25.1 | 114.94,8.96 114.94,8.89 | 114.94,8.96 114.94,10.79 118.06,10.79 Q2.1 | IC4.19 60.43,52.81 61.59,53.98 61.59,60.33 62.23,60.96 67.31,60.96
  Bottom 0.61: IC4.19 56.41,52.81 53.98,55.24 50.92,55.24 IC4.1 | v107.18,31.75 102.87,31.75 102.23,31.11 102.23,23.5 114.94,10.79 | 67.31,60.96 67.6,60.67 IC5.1 83.18,63.49 85.72,66.04 IC5.19
A_DIR_3V
  Bottom 0.406: U$1.61 61.61,36.84 60.96,36.2 60.96,35.02 IC4.11
A_DIR_5V
  Bottom 0.406: 67.94,48.26 62.23,48.26 61.59,48.9
  Bottom 0.61: J4.2 100.74,92.3 101.6,91.44 101.6,87 100.97,86.36 89.53,86.36 88.9,85.72 RN1.9 87,71.12 87,52.07 83.19,48.26 67.94,48.26 | 61.59,48.9 60.33,50.16 58.54,50.16 IC4.18
A_STEP_5V
  Bottom 0.61: J4.3 102.01,94.84 102.87,93.98 102.87,86.36 101.6,85.09 92.08,85.09 91.44,84.45 RN1.8 91.44,72.39 89.53,70.48 89.53,65.41 88.26,64.13 IC5.3
B_DIR_5V  (via drill 0.8)
  Top 0.61: v70.48,74.3 v70.48,40.01
  Bottom 0.406: IC4.14 61.7,40.11 62.23,40.64 67.31,40.64 67.94,40.01 v70.48,40.01
  Bottom 0.61: v70.48,74.3 70.48,80.01 R40.1 80.01,89.53 86.36,89.53 89.12,92.3 J5.2
B_STEP_5V  (via drill 0.8)  (1 unrouted)
  Top 0.61: v68.58,76.2 v68.58,43.81
  Bottom 0.406: 58.54,45.09 59.69,45.09 61.59,43.18 67.94,43.18 v68.58,43.81
  Bottom 0.61: v68.58,76.2 68.58,81.28 R41.1 78.11,90.81 85.09,90.81 89.12,94.84 J5.3
ENABLE_5V  (via drill 0.8)
  Top 0.61: v119.38,87 v113.25,87 v106.05,87 R42.1 80.64,83.82 85.72,78.74 85.72,72.11 IC5.18
  Bottom 0.61: J4.1 J5.1 89.12,89.76 87.63,88.27 81.92,88.27 R42.1 | J1.1 106.12,87.08 v106.05,87 | v113.25,87 113.25,89.74 J2.1 | J3.1 120.42,88.03 v119.38,87
ENCODER0_A
  Top 0.61: IC2.11 133.35,17.78 138.43,12.7 152.4,12.7 153.67,13.97 153.67,16.51 152.91,17.27 LED2.K
  Bottom 0.61: J7.2 LED2.K
ENCODER0_B
  Top 0.61: IC2.13 134.62,22.86 136.53,24.77 153.03,24.77 154.31,26.04 154.31,28.57 153.67,29.21 152.06,29.21 LED3.K
  Bottom 0.61: J8.2 LED3.K
ENCODER0_I
  Top 0.61: IC2.9 133.35,12.7 134.62,11.43 134.62,8.89 135.89,7.62 149.65,7.62 LED1.K
  Bottom 0.61: J6.2 LED1.K
ENCODER2_A
  Top 0.61: IC6.9 133.37,48.24 134.62,46.99 134.62,44.45 135.89,43.18 150.73,43.18 152,41.91 LED4.K
  Bottom 0.61: J9.2 LED4.K
ENCODER2_B
  Top 0.406: IC6.11 132.06,53.32 132.08,53.34 | 152.07,53.34 LED5.K
  Top 0.61: 132.08,53.34 133.35,53.34 138.43,48.26 152.4,48.26 153.67,49.53 153.67,52.07 152.4,53.34 152.07,53.34
  Bottom 0.61: J10.2 LED5.K
ENCODER2_I
  Top 0.406: 153.67,64.83 153.25,65.25 | 152.02,65.25 LED6.K
  Top 0.61: IC6.13 134.6,58.4 137.16,60.96 152.4,60.96 153.67,62.23 153.67,64.83 | 153.25,65.25 152.02,65.25
  Bottom 0.61: J11.2 LED6.K
EQEP0A  (via drill 0.8)
  Top 0.406: 110.49,25.4 115.57,25.4
  Top 0.61: v72.39,69.85 77.47,64.77 77.47,48.26 100.33,25.4 110.49,25.4 | 115.57,25.4 116.2,25.4 122.56,19.05 125.73,19.05 129.54,15.24 IC2.10
  Bottom 0.61: U$1.88 72.38,69.86 v72.39,69.85
EQEP0B  (via drill 0.8)
  Top 0.406: 110.49,27.94 115.57,27.94
  Top 0.61: v79.38,53.34 79.38,48.26 99.69,27.94 110.49,27.94 | 115.57,27.94 121.92,21.59 130.54,21.59 IC2.12
  Bottom 0.406: U$1.73 63.51,52.08 64.77,53.34 v79.38,53.34
EQEP0I  (via drill 0.8)
  Top 0.406: 110.49,22.86 116.2,22.86
  Top 0.61: 116.2,22.86 116.52,22.54 122.56,16.51 126.36,16.51 128.91,13.97 128.91,12.06 130.81,10.16 IC2.8 | v75.56,64.14 76.2,63.5 76.2,47.62 100.97,22.86 110.49,22.86
  Bottom 0.406: U$1.87 63.49,69.86 64.77,68.58 67.31,68.58
  Bottom 0.61: 67.31,68.58 71.12,68.58 v75.56,64.14
EQEP2A  (via drill 0.8)
  Top 0.61: v131.44,33.02 119.38,33.02 v117.47,31.11
  Bottom 0.406: IC6.8 131.81,33.38 v131.44,33.02 | v117.47,31.11 114.81,31.11 U$1.12
EQEP2B  (via drill 0.8)
  Top 0.61: v129.54,36.83 121.28,36.83 v117.47,33.02
  Bottom 0.406: v117.47,33.02 112.88,33.02 U$1.11
  Bottom 0.61: IC6.10 130.79,50.78 129.54,49.53 v129.54,36.83
EQEP2I  (via drill 0.8)
  Top 0.61: v127.64,39.37 121.28,39.37 v118.75,36.83
  Bottom 0.406: 114.18,36.83 U$1.16
  Bottom 0.61: IC6.12 130.79,55.86 128.27,53.34 128.27,43.18 127.64,42.55 v127.64,39.37 | v118.75,36.83 114.18,36.83
ESTOP_IN_3V  (via drill 0.8)
  Top 0.61: v104.14,55.88 102.87,57.15 v81.28,57.15
  Bottom 0.406: 110.49,58.42 115.57,58.42
  Bottom 0.61: U$1.76 67.32,54.62 67.94,55.24 80.01,55.24 81.28,56.52 v81.28,57.15 | IC3.2 124.15,81.28 123.19,81.28 118.11,76.2 118.11,60.33 116.2,58.42 115.57,58.42 | v104.14,55.88 107.95,55.88 110.49,58.42
ESTOP_IN_5V  (via drill 0.8)
  Top 0.61: v105.66,57.78 v105.66,29.84
  Bottom 0.406: Q2.3 118.48,12.77 120,11.25 120.83,11.25 123.83,8.26 124.53,8.26 LED13.K | 110.49,60.96 115.57,60.96
  Bottom 0.61: LED13.K 126.84,6.35 131.44,6.35 132.42,5.38 J22.2 | IC3.1 124.15,83.82 123.19,83.82 116.84,77.47 116.84,61.59 116.2,60.96 115.57,60.96 | v105.66,29.84 105.66,21.98 113.67,13.97 118.26,13.97 Q2.3 | v105.66,57.78 106.68,57.78 109.86,60.96 110.49,60.96
ESTOP_OUT_3V  (via drill 0.8)
  Top 0.61: v74.3,52.07 74.3,47.62 v93.98,27.94
  Bottom 0.406: Q1.2 118.71,5.08 111.76,5.08 110.83,4.14 R22.2 110.78,3.81 | 74.28,52.08 v74.3,52.07
  Bottom 0.61: U$1.74 74.28,52.08 | 110.78,3.81 109.86,3.81 109.22,4.45 109.22,14.61 95.89,27.94 v93.98,27.94
ESTOP_OUT_5V
  Bottom 0.406: 121.7,5.93 Q1.1 115.99,5.93 R24.1
  Bottom 0.61: J22.1 129.38,4.45 123.19,4.45 121.7,5.93
GND  (via drill 0.8)
  Top 0.406: IC4.10
  Top 0.61: R22.1 112.14,7.62 121.28,7.62 122.56,6.35 122.56,4.45 121.5,3.4 Q1.3 | v145.41,36.83 v157.48,36.83 | IC2.7 123.19,10.16 121.92,11.43 121.92,14.61 117.47,19.05 v116.59,19.05 | 59.69,19.05 v60.33,19.05 57.15,19.05 50.8,25.4 IC4.10 | IC5.10 106.04,61.6 104.78,62.87 80.64,62.87 80.01,62.23 80.01,61.59
  Bottom 0.406: 124.21,45.72 IC6.7 | IC2.7 125.09,10.16 126.36,11.43 126.36,28.23 | R37.2 35.55,50.8 35.56,50.8 | 35.56,50.8 35.56,46.35 | U$1.2 116.83,19.06 v116.59,19.05 | 137.38,1.27 127.64,1.27 125.73,3.17 121.25,3.17 Q1.3 | 58.42,82.55 67.94,92.08 R41.2 R40.2 R42.2 91.03,97.38 J5.4 J4.4 J1.4 J2.4 J3.4 126.14,97.38 126.36,97.16 126.36,96.52 | LED18.K 51.21,98.02 50.8,98.42 | C2.- 60.33,69.07 60.33,54.61 59.69,53.98 57.15,53.98 52.38,58.74 C8.2 48.26,59.05 45.09,55.88 45.09,52.7 | 60.34,19.06 v60.33,19.05 | 109.86,76.2 114.3,76.2 125.09,87 125.41,86.68 C7.2 127.64,85.8 127.64,81.92 128.31,81.24 IC3.13 127.64,77.06 127.64,69.22 126.96,68.54 IC3.7 126.68,66.05 C6.2 126.68,46.67 | 35.56,50.8 35.56,51.44 36.83,52.7 R35.2 | R35.2 41.91,50.69 R38.2 | R36.2 46.99,50.8 45.09,52.7 | 45.09,52.7 R35.2
  Bottom 0.61: 126.68,46.67 125.73,45.72 124.21,45.72 | J13.3 J12.3 J11.3 J10.3 J9.3 J8.3 | J8.3 J7.3 J6.3 | J21.3 J20.3 J19.3 J18.3 J17.3 J16.3 | J16.3 J15.3 J14.3 142.54,2.84 140.97,1.27 137.38,1.27 137.38,1.52 J22.3 | IC1.3 50.8,98.42 31.11,98.42 31.11,96.99 X5.2 31.75,93.8 31.75,83.82 32.88,82.69 C1.- 32.73,79.8 T1.1 | 58.31,79.75 D1.A 58.31,80 U$1.91 U$1.89 U$1.90 | U$1.90 U$1.92 | T2.1 35.19,46.73 35.56,46.35 35.56,41.92 T3.1 34.7,37.05 35.91,35.85 DC1.1 41.62,35.85 45.09,32.38 50.7,32.38 IC4.10 | R39.2 32.24,52.07 R37.2 | IC2.7 127,10.16 128.91,8.26 132.72,8.26 134.96,6.01 J22.3 | U$1.48 U$1.47 60.34,19.06 | 134.96,3.69 J22.3 | U$1.1 U$1.2 | J16.3 142.59,34 v145.41,36.83 | v157.48,36.83 157.48,35.56 156.21,34.29 154.83,34.29 J8.3 | J13.3 154.54,94.38 154.31,94.61 | J13.3 154.54,96.92 153.67,97.79 120.83,97.79 J3.4 | U$1.90 72.03,72.4 79.98,64.45 C9.2 | IC5.10 106.39,60.67 109.22,63.5 RN1.1 109.22,75.56 109.86,76.2
  Bottom 0.813: IC1.3 50.8,93.34 52.07,94.61 53.98,94.61 54.61,93.98 54.61,88.04 IC1.5 | C2.- 56.85,80.96 D1.A
  Bottom 1.016: IC1.5 57.15,87.63 58.42,86.36 58.42,82.55 58.42,82.53 D1.A
  pour Bottom (isolate 0.813): 26.67,100.33 161.29,100.33 161.29,-1.27 100.97,-1.27 100.97,18.41 81.28,18.41 81.28,-1.27 59.69,-1.27 59.69,24.13 52.7,31.11 26.67,31.11
INHIBIT
  Bottom 0.61: 48.38,52.7 IC4.3 | R35.1 R43.1
  Bottom 0.813: R35.1 48.38,52.7
LIMIT_X_MAX
  Top 0.61: LED8.K 153.3,89.27 153.67,88.9 153.67,86.36 152.4,85.09 137.16,85.09 134.62,82.55 134.62,78.97 IC3.11
  Bottom 0.61: J13.2 LED8.K
LIMIT_X_MIN
  Top 0.406: 131.85,71.12 IC3.9
  Top 0.61: LED7.K 152.6,77.27 153.67,76.2 153.67,74.3 152.4,73.03 136.53,73.03 134.62,71.12 131.85,71.12
  Bottom 0.61: J12.2 LED7.K
LIMIT_Y_MAX
  Top 0.61: IC2.3 127,20.32 128.27,19.05 138.73,19.05 140,17.78 LED10.K
  Bottom 0.61: J15.2 LED10.K
LIMIT_Y_MIN
  Top 0.61: IC2.5 125.73,15.24 127,13.97 127,12.06 130.18,8.89 133.35,8.89 135.89,6.35 138.92,6.35 LED9.K
  Bottom 0.61: J14.2 LED9.K
LIMIT_Z_MAX
  Top 0.406: LED12.K
  Top 0.61: IC6.5 125.75,50.78 127,49.53 127,42.55 128.27,41.27 LED12.K
  Bottom 0.61: J17.2 LED12.K
LIMIT_Z_MIN
  Top 0.61: IC2.1 128.27,25.4 129.54,26.67 137.4,26.67 LED11.K
  Bottom 0.61: J16.2 LED11.K
MACHINE_PWR
  Bottom 0.406: U$1.7 111.75,26.68 113.03,25.4 115.57,25.4
  Bottom 0.61: 115.57,25.4 116.2,25.4 118.11,23.5 118.11,16.51 120.65,13.97 120.65,12.74 Q2.2
N$1
  Top 0.61: LED8.A 148.23,86.73 R21.1
N$2
  Top 0.61: LED7.A 148.23,74.73 R19.1
N$3
  Bottom 1.016: IC1.2 49.1,85.93 45.59,82.42 D1.C 41.77,82.42 34.29,74.93 34.29,67.99 L1.P$1
N$4
  Top 0.61: LED6.A 148.23,62.73 R18.1
N$5
  Top 0.61: LED5.A 148.23,50.73 R17.1
N$6
  Top 0.61: LED4.A 148.23,38.73 R16.1
N$7
  Top 0.61: LED16.A 143.77,74.73 R2.1
N$8
  Top 0.61: LED15.A 143.77,62.73 R3.1
N$9
  Top 0.61: LED14.A 143.77,50.73 R4.1
N$10
  Bottom 0.61: LED13.A 121.36,8.89 R5.1
N$11
  Top 0.61: 143.77,38.73 R6.1
  Top 0.813: LED12.A 143.77,38.73
N$12
  Top 0.61: LED3.A 148.23,26.73 R12.1
N$13
  Top 0.61: LED2.A 148.23,14.73 R11.1
N$14
  Top 0.813: R27.2 48.53,10.53 45.09,13.97 45.09,23.75 R26.2
  Bottom 0.813: R34.3 31.3,25.59 33.95,28.23 DC1.4 40.77,28.23 44.45,24.55 44.45,24.13 42.55,22.23 42.55,21.9 | C3.1 40.91,12.91 IC7.8 42.55,16.51 42.55,21.9 | 42.55,21.9 R26.2 | R31.2 52.8,1.3 R27.2
N$15
  Bottom 0.61: T1.2 29.32,67.3 R13.2
N$16
  Top 0.61: LED1.A 148.23,2.73 R10.1
N$17
  Bottom 0.61: D2.A 24.26,92.99 K1.2 23.81,84.03 T1.3
N$18
  Bottom 1.676: X1.6 16.27,67.5 K1.S2
N$19
  Bottom 1.676: X1.4 16.29,77.5 K1.O2
N$20
  Bottom 1.676: X1.5 16.27,72.5 K1.P2
N$21
  Bottom 1.676: X1.3 4.5,82.5 2,80 2,72 4,70 21.36,70 K1.S1
N$22
  Bottom 1.676: K1.P1 20,76.36 20,79.06 11.56,87.5 X1.2
N$23
  Bottom 1.676: X1.1 10.37,92.5 23.81,79.06 K1.O1
N$24
  Bottom 0.61: T2.2 32.83,48 R14.2
N$25
  Bottom 0.61: T2.3 D3.A
  Bottom 1.27: K2.1 18.88,62.54 D3.A
N$26
  Bottom 1.676: X2.6 16.27,37.5 K2.S2
N$27
  Bottom 1.676: X2.4 16.29,47.5 K2.O2
N$28
  Bottom 1.676: X2.5 16.27,42.5 K2.P2
N$29
  Bottom 1.676: X2.3 4.5,52.5 2,50 2,42 4,40 21.36,40 K2.S1
N$30
  Bottom 1.676: X2.2 12.35,57.5 20,49.85 20,46.36 K2.P1
N$31
  Bottom 1.676: X2.1 11.16,62.5 23.81,49.85 K2.O1
N$32
  Bottom 0.61: T3.2 33.44,45.28 R15.2
N$33
  Bottom 0.61: D4.A 32.15,41.08 T3.3
  Bottom 1.016: K3.1 18.57,32.54 20.95,34.92 26.67,34.92 28.79,37.04 D4.A
N$34
  Bottom 1.676: X3.6 16.27,7.5 K3.S2
N$35
  Bottom 1.676: X3.4 16.29,17.5 K3.O2
N$36
  Bottom 1.676: X3.5 16.27,12.5 K3.P2
N$37
  Bottom 1.676: X3.3 4.5,22.5 2,20 2,12 4,10 21.36,10 K3.S1
N$38
  Bottom 1.676: X3.2 12.51,27.5 20,20 20,16.36 K3.P1
N$39
  Bottom 1.676: X3.1 11.31,32.5 23.5,20.32 23.5,17.84 K3.O1
N$40
  Top 0.61: LED9.A 143.77,2.73 R9.1
N$41
  Top 0.61: LED10.A 143.77,14.73 R8.1
N$42
  Top 0.61: LED11.A 143.77,26.73 R7.1
N$43
  Top 0.61: LED17.A 143.77,86.73 R20.1
N$44
  Bottom 0.406: 65.8,92.47 R1.1
  Bottom 0.61: LED18.A 65.8,92.47
N$45  (1 unrouted)
  Top 0.61: 44.35,35.47 44.35,40.73 43.18,41.91 43.18,49.03 R23.2
N$46
  Bottom 0.61: OK2.4 57.78,10.16 54.61,6.99 45.09,6.99 44.59,6.49 X4.4
N$47
  Top 0.813: IC7.2 49.5,18.39 R26.1
  Bottom 0.813: OK1.4 46.9,27.02 R26.1
N$48
  Top 0.813: R27.1 53.61,12.16 R29.2
  Bottom 0.813: IC7.3 47.63,19.05 50.16,19.05 50.9,18.32 R28.2 R29.2
N$49
  Top 0.813: R31.1 48.93,1.3 50.8,3.17 51.44,3.17 | 51.44,3.17 53.43,3.17 R30.1 | R29.1 50.9,3.71 51.44,3.17
  Bottom 0.813: R29.1 50.9,11.96 48.9,13.97 47.63,13.97 IC7.1
N$50
  Top 0.813: R30.2 47.45,3.35 46.99,3.81 46.99,6.99 43.18,10.79 43.18,15.72 IC7.6
  Bottom 0.813: IC7.6 38.88,18.97 R32.1 C4.2
N$51
  Bottom 0.61: X4.3 39.59,5.93 41.91,8.26 53.34,8.26 55.24,10.16 OK2.3
N$52
  Top 0.406: 53.34,53.98 43.18,53.98 R43.2
  Top 0.61: OK2.2 55.24,31.75 53.98,33.02 53.98,53.34 53.34,53.98
N$53
  Bottom 0.813: R33.1 41.56,24.41 40.01,22.86 40.01,21.58 IC7.5
N$54
  Bottom 0.813: R34.2 35.1,22.08 R33.2
P808
  Bottom 0.61: U$1.8 118.1,26.68 119.38,25.4 119.38,17.51 IC2.6
P809  (via drill 0.8)
  Top 0.406: 109.86,50.8 117.47,50.8
  Top 0.61: IC3.10 130.13,73.62 128.91,72.39 121.28,72.39 120.02,71.12 120.02,53.34 117.47,50.8 | v108.58,29.84 108.58,49.53 109.86,50.8
  Bottom 0.406: U$1.9
  Bottom 0.61: v108.58,29.84 111,29.84 U$1.9
P810  (via drill 0.8)
  Top 0.61: v133.35,32.38 133.35,31.11 132.72,30.48 119.38,30.48 v118.11,29.21
  Bottom 0.406: v118.11,29.21 114.18,29.21 U$1.10
  Bottom 0.61: IC3.8 131.81,67.67 128.27,64.14 128.27,57.78 128.91,57.15 133.35,57.15 134.62,55.88 134.62,33.66 v133.35,32.38
P813
  Bottom 0.61: IC5.8 100.96,36.84 103.5,34.29 U$1.13
P814
  Bottom 0.61: U$1.14 115.58,34.3 116.2,34.92 119.38,34.92 120.65,33.66 120.65,20.32 123.19,17.78 IC2.4
P815  (via drill 0.8)
  Top 0.61: v99.69,36.2 v104.14,36.2
  Bottom 0.61: IC5.13 100.96,64.13 99.69,62.87 v99.69,36.2 | v104.14,36.2 110.98,36.2 U$1.15
P817
  Bottom 0.406: U$1.17 111.75,39.38 113.03,38.1 115.57,38.1
  Bottom 0.61: 115.57,38.1 117.47,38.1 118.11,38.73 120.02,38.73 121.92,36.83 121.92,24.13 123.19,22.86 IC2.2
P818  (via drill 0.8)
  Top 0.61: v120.65,48.26 120.65,43.18 v118.11,40.64
  Bottom 0.406: 120.67,48.24 v120.65,48.26 | 114.18,39.37 U$1.18
  Bottom 0.61: IC6.6 120.67,48.24 | 123.19,48.26 v120.65,48.26 | v118.11,40.64 116.84,39.37 114.18,39.37
P819
  Bottom 0.61: IC5.11 106.04,64.76 104.78,63.5 104.78,59.05 104.14,58.42 102.87,58.42 102.23,57.78 102.23,43.81 104.14,41.91 U$1.19
P914
  Bottom 0.61: U$1.60 91.45,34.3 94.61,37.47 94.61,55.24 97.16,57.78 97.16,64.77 95.88,66.05 IC5.15
P920
  Bottom 0.61: IC5.6 95.88,59.05 93.34,56.52 93.34,43.81 91.44,41.91 U$1.66
P922  (1 unrouted)
  Bottom 0.61: U$1.68 66.67,44.45 67.94,45.72 89.53,45.72 92.08,48.26 92.08,63.5 90.81,64.77 IC5.17
P924
  Bottom 0.61: U$1.70 88.27,46.99 90.81,49.53 IC5.4
P926
  Bottom 0.61: U$1.72 82.55,49.53 85.72,52.7 IC5.2
PWM0_5V
  Bottom 0.61: IC4.5 47.02,45.19 R36.1 R23.1
PWM0B_3V
  Bottom 0.406: IC4.2 53.87,52.81 55.24,51.44 59.69,51.44 60.33,52.07 60.81,52.07 U$1.75
PWM1B_3V
  Bottom 0.406: U$1.62 65.91,37.6 65.41,38.1 60.96,38.1 60.33,37.47 58.54,37.47 IC4.13
RELAY1_5V
  Top 0.61: R13.1 42.1,60.52 44.45,62.87 52.07,62.87 55.88,59.05 55.88,35.56 56.41,35.03 IC4.12
  Bottom 0.406: 31.01,57.26 R39.1
  Bottom 0.813: R13.1 31.01,57.26
RELAY2_5V
  Bottom 0.406: 38.54,50.73 R37.1
  Bottom 0.61: 38.54,50.73 R14.1 38.91,48.26 41.91,48.26 43.18,46.99 43.18,41.91 44.45,40.64 48.9,40.64 49.42,40.11 IC4.7
RELAY3_5V
  Bottom 0.406: 41.44,45.3 R38.1 | IC4.9 50.69,35.03 | 38.73,45.11 R15.1
  Bottom 0.61: R15.1 41.44,45.3 | 50.69,35.03 48.9,36.83 48.9,38.1 47.62,39.37 39.37,39.37 38.73,40.01 38.73,45.11
SPINDLE+
  Bottom 0.813: C4.1 R32.2 36.33,12.82 IC7.7
  Bottom 1.016: C4.1 31.02,11.34 29.59,9.9 X4.1
SPINDLE-
  Bottom 0.813: R34.1 30.62,19.54 28.57,21.59 28.57,26.67 32.67,30.77 DC1.3 40.35,30.77 43.18,27.94 44.34,27.94 OK1.3 44.35,26.77 47.62,23.5 47.62,21.58 IC7.4 | IC7.4 45.99,19.95 C3.2 44.48,9.53 36.83,9.53 34.59,7.28 X4.2 | IC7.4 50.22,21.51 R28.1
SW1_3V
  Bottom 0.406: 114.18,49.53 U$1.26
  Bottom 0.61: IC6.4 121.9,53.32 118.11,49.53 114.18,49.53
SW1_5V
  Top 0.61: IC6.3 127.02,55.86 128.27,54.61 138.66,54.61 LED14.K
  Bottom 0.61: J18.2 LED14.K
SW2_3V  (via drill 0.8)
  Top 0.813: v96.52,48.26 v104.14,48.26
  Bottom 0.406: 109.86,50.8 115.57,50.8
  Bottom 0.61: U$1.58 95.26,31.76 96.52,33.02 v96.52,48.26 | 115.57,50.8 116.2,50.8 121.92,56.52 121.92,57.15 123.19,58.42 124.17,58.42 | v104.14,48.26 107.31,48.26 109.86,50.8
  Bottom 0.813: 124.17,58.42 IC6.2
SW2_5V
  Top 0.61: IC6.1 126.98,60.94 128.27,62.23 136.96,62.23 LED15.K
  Bottom 0.61: J19.2 LED15.K
SW3_3V  (via drill 0.8)
  Top 0.61: v104.14,50.8 101.6,50.8 100.97,51.44 v81.42,51.44
  Bottom 0.406: U$1.71 63.51,49.54 64.77,50.8 78.11,50.8 78.74,51.44 v81.42,51.44 | 109.86,53.34 115.57,53.34
  Bottom 0.61: 115.57,53.34 116.2,53.34 120.65,57.78 120.65,69.85 121.92,71.12 124.15,71.12 IC3.6 | v104.14,50.8 107.31,50.8 109.86,53.34
SW3_5V
  Top 0.406: 124.23,73.66 IC3.5
  Top 0.61: LED16.K 135.69,77.27 133.35,74.93 129.54,74.93 128.27,73.66 124.23,73.66
  Bottom 0.61: J20.2 LED16.K
SW4_3V  (via drill 0.8)
  Top 0.61: v79.24,57.15 79.38,57.02 79.38,55.88 81.92,53.34 v104.14,53.34
  Bottom 0.406: U$1.77 63.51,57.16 64.77,58.42 67.31,58.42 | 115.57,55.88 110.49,55.88
  Bottom 0.61: IC3.4 124.15,76.2 120.65,76.2 119.38,74.93 119.38,58.42 116.84,55.88 115.57,55.88 | v79.24,57.15 68.58,57.15 67.31,58.42 | v104.14,53.34 107.95,53.34 110.49,55.88
SW4_5V
  Top 0.406: 124.23,78.74 IC3.3
  Top 0.61: LED17.K 131.18,89.27 129.54,87.63 129.54,79.38 128.91,78.74 124.23,78.74
  Bottom 0.61: J21.2 LED17.K
VCC
  Bottom 1.27: X5.1 34.84,88.56 C1.+ | C1.+ 38.24,87.77 | C1.+ 47.26,87.77 IC1.1
VDD_3V3EXP  (via drill 0.8)
  Top 0.61: v68.58,21.59 v68.58,29.84 | v97.92,31.89 97.92,44.2 99.69,45.72 v104.14,45.72 | v116.84,45.72 116.84,47.62 121.92,52.7 121.92,64.14 123.19,65.41 130.47,65.41 C6.1
  Bottom 0.4: 109.86,45.72 115.57,45.72
  Bottom 0.406: 131.76,25.45 IC2.14 | 131.76,60.99 IC6.14
  Bottom 0.61: U$1.49 U$1.50 68.57,21.6 v68.58,21.59 | C7.1 131.81,86.66 IC3.14 131.85,83.82 133.35,83.82 134.62,82.55 134.62,66.67 132.06,64.11 C6.1 131.81,64.06 IC6.14 131.83,60.96 134.62,60.96 135.89,59.69 135.89,29.84 134.59,28.54 C5.1 131.76,25.45 | v68.58,29.84 95.89,29.84 v97.92,31.89 | v104.14,45.72 109.86,45.72 | 115.57,45.72 v116.84,45.72
VDD_5V  (via drill 0.8)
  Top 0.61: v147.32,1.52 v124.46,1.52 124.44,1.5 | OK1.1 46.9,34.83 46.35,34.29 39.71,34.29 39.5,34.5 32.37,34.5 D4.C
  Top 0.813: D4.C 26.67,33.03 26.67,61.91 27.3,62.54 28.96,62.54 D3.C | v64.77,78.11 61.59,78.11 60.33,76.83 60.33,57.25 IC4.20 | v64.77,78.11 64.77,86.36 R1.2 | v64.77,78.11 77.47,78.11 83.19,72.39 IC5.20
  Bottom 0.406: 147.3,33.04 147.32,33.02 | 137.16,34.29 137.17,34.29 J16.1 | 148.35,81.04 148.59,81.28 | 137.42,93.96 J21.1 | J18.1 137.46,58.12 | R25.2 115,3.81
  Bottom 0.61: R9.2 R10.2 148.5,9.04 J6.1 | R8.2 R11.2 148.5,21.04 J7.1 | R7.2 R12.2 147.3,33.04 | 147.32,33.02 148.48,33.02 J8.1 | R6.2 R16.2 148.5,45.04 J9.1 | R4.2 R17.2 148.5,57.04 J10.1 | R3.2 R18.2 148.5,69.04 J11.1 | R2.2 R19.2 148.35,81.04 | R20.2 R21.2 148.5,93.04 J13.1 | 148.59,81.28 149.46,81.28 | J13.1 149.46,95.65 148.59,96.52 138.43,96.52 137.46,95.55 J21.1 J20.1 J19.1 J18.1 J17.1 J16.1 J15.1 J14.1 | J13.1 J12.1 149.46,81.28 | J11.1 149.46,81.28 | J9.1 J10.1 | J8.1 J9.1 | J6.1 J7.1 | J7.1 J8.1 | J10.1 J11.1 | D2.C 14.1,94.76 K1.1 16.32,89.73 27.3,78.74 27.3,66.03 K2.2 | IC4.20 58.43,58.1 C8.1 | J6.1 149.46,3.41 v147.32,1.52 | v124.46,1.52 118.5,1.52 R5.2
  Bottom 0.813: C8.1 51.77,64.75 C2.+ 50.28,72.54 L1.P$2 40.32,62.58 D3.C 28.96,62.54 K2.2 | R25.2 R24.2 113.03,3.81 113.03,2.54 112.39,1.91 109.22,1.91 107.95,3.17 107.95,13.97 97.78,24.14 U$1.52 U$1.51 OK2.1 57.78,26.67 53.69,30.77 42.89,30.77 40.35,33.31 DC1.2 31.18,33.31 D4.C | 115,3.81 R5.2 | IC5.20 81.28,68.29 C9.1
  Bottom 1.016: IC1.4 52.5,84.89 45.09,77.47 45.09,68.33 L1.P$2 | 28.93,30.77 D4.C 25.43,30.92 K3.2
X_DIR_3V
  Bottom 0.406: IC4.15 60.22,42.65 60.96,41.91 U$1.65
X_DIR_5V
  Bottom 0.61: J1.2 107.72,92.3 108.58,91.44 108.58,85.09 107.31,83.82 94.61,83.82 93.98,83.19 RN1.7 93.98,71.75 93.34,71.12 93.34,68.93 IC5.16
X_STEP_5V
  Bottom 0.61: J1.3 109,94.84 109.86,93.98 109.86,84.45 107.95,82.55 97.16,82.55 96.52,81.92 RN1.6 96.52,72.39 94.61,70.48 94.61,65.41 93.34,64.14 93.34,61.31 IC5.5
Y_DIR_3V
  Bottom 0.406: U$1.57 62.24,31.76 60.33,29.84 56.52,29.84 53.34,33.02 53.34,36.2 52.07,37.47 50.92,37.47 IC4.8
Y_DIR_5V
  Bottom 0.61: J2.2 114.71,92.3 115.57,91.44 115.57,84.45 112.39,81.28 99.69,81.28 99.06,80.64 RN1.5 99.06,71.75 98.42,71.12 98.42,68.93 IC5.14
Y_STEP_3V
  Bottom 0.406: U$1.59 62.24,34.3 60.96,33.02 60.96,31.75 60.33,31.11 56.52,31.11 54.61,33.02 54.61,41.27 53.34,42.55 50.92,42.55 IC4.6
Y_STEP_5V
  Bottom 0.61: J2.3 115.98,94.84 116.84,93.98 116.84,83.82 113.03,80.01 102.23,80.01 101.6,79.38 RN1.4 101.6,72.39 99.69,70.48 99.69,65.41 98.42,64.14 98.42,61.31 IC5.7
Z_DIR_3V
  Bottom 0.406: IC4.17 60.85,47.73 61.59,46.99 U$1.69
Z_DIR_5V
  Bottom 0.61: J3.2 122.33,92.3 123.19,91.44 123.19,88.52 113.42,78.74 104.78,78.74 104.14,78.11 RN1.3 104.14,71.12 103.5,70.48 IC5.12
Z_STEP_3V
  Bottom 0.406: U$1.67 62.85,44.46 60.96,46.35 55.24,46.35 53.98,47.62 50.92,47.62 IC4.4
Z_STEP_5V
  Bottom 0.61: IC5.9 103.5,61.31 103.5,64.14 104.78,65.41 104.78,69.85 106.68,71.75 RN1.2 106.68,76.83 107.31,77.47 113.8,77.47 124.33,88.02 124.33,94.11 123.83,94.61 120.64,94.61 J3.3

### Text on the board
DrillLegend: LAYER-STACK
DrillLegend_01-16: 01-16
DrillLegend_01-20: 01-20